# EAGLE schematic rev_n v28 (EAGLE 9.7.0)
AUTHOR: Pat Pannuto; REV: N; TITLE: TotTag

## Sheet 1 of 6: Power
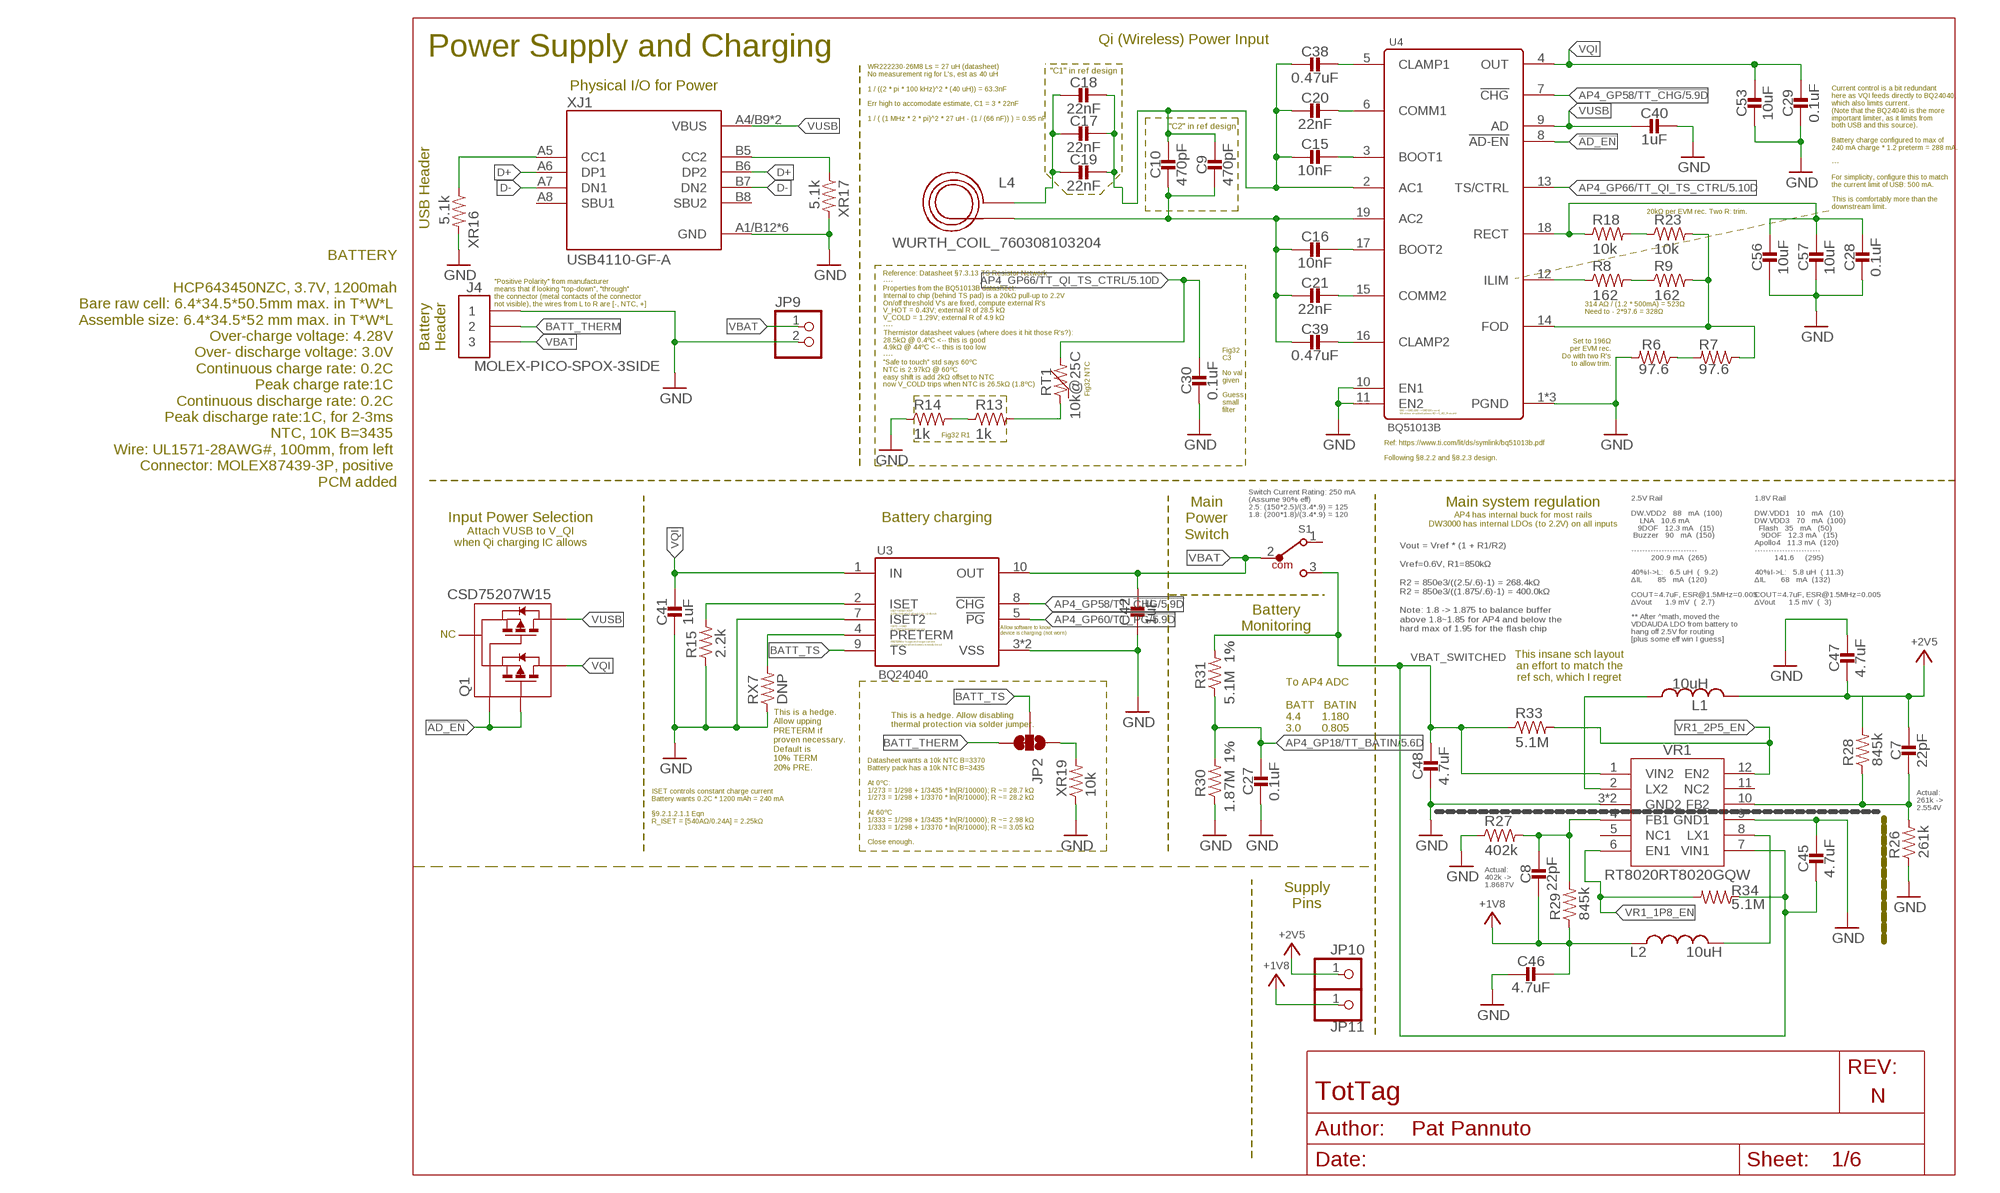
[diagram p0: schematic, sheet 1]

### Parts
C7  22pF  CAPACITOR0201_CAP  [0201_CAP]
C8  22pF  CAPACITOR0201_CAP  [0201_CAP]
C9  470pF  CAPACITOR0402_CAP  [0402_CAP]
C10  470pF  CAPACITOR0402_CAP  [0402_CAP]
C15  10nF  CAPACITOR0402_CAP  [0402_CAP]
C16  10nF  CAPACITOR0402_CAP  [0402_CAP]
C17  22nF  CAPACITOR0402_CAP  [0402_CAP]
C18  22nF  CAPACITOR0402_CAP  [0402_CAP]
C19  22nF  CAPACITOR0402_CAP  [0402_CAP]
C20  22nF  CAPACITOR0402_CAP  [0402_CAP]
C21  22nF  CAPACITOR0402_CAP  [0402_CAP]
C27  0.1uF  CAPACITOR0402_CAP  [0402_CAP]
C28  0.1uF  CAPACITOR0402_CAP  [0402_CAP]
C29  0.1uF  CAPACITOR0402_CAP  [0402_CAP]
C30  0.1uF  CAPACITOR0402_CAP  [0402_CAP]
C38  0.47uF  CAPACITOR0402_CAP  [0402_CAP]
C39  0.47uF  CAPACITOR0402_CAP  [0402_CAP]
C40  1uF  CAPACITOR0402_CAP  [0402_CAP]
C41  1uF  CAPACITOR0402_CAP  [0402_CAP]
C42  1uF  CAPACITOR0402_CAP  [0402_CAP]
C45  4.7uF  CAPACITOR0603_CAP  [0603_CAP]
C46  4.7uF  CAPACITOR0603_CAP  [0603_CAP]
C47  4.7uF  CAPACITOR0603_CAP  [0603_CAP]
C48  4.7uF  CAPACITOR0603_CAP  [0603_CAP]
C53  10uF  CAPACITOR0603_CAP  [0603_CAP]
C56  10uF  CAPACITOR0603_CAP  [0603_CAP]
C57  10uF  CAPACITOR0603_CAP  [0603_CAP]
J4  MOLEX-PICO-SPOX-3SIDE  [MOLEX-PICO-SPOX-3_SIDE]
JP2  JUMPER-SMT_3_1-NC_TRACE_SILK  [SMT-JUMPER_3_1-NC_TRACE_SILK]
JP9  PINHD-1X2  [1X02]
JP10  PINHD-1X1  [1X01]
JP11  PINHD-1X1  [1X01]
L1  10uH  INDUCTORNRX3015  [NRX3015]
L2  10uH  INDUCTORNRX3015  [NRX3015]
L4  WURTH_COIL_760308103204  [WURTH_COIL_760308103204]
Q1  CSD75207W15  [DSBGA]
R6  97.6  RESISTOR0402_RES  [0402_RES]
R7  97.6  RESISTOR0402_RES  [0402_RES]
R8  162  RESISTOR0402_RES  [0402_RES]
R9  162  RESISTOR0402_RES  [0402_RES]
R13  1k  RESISTOR0402_RES  [0402_RES]
R14  1k  RESISTOR0402_RES  [0402_RES]
R15  2.2k  RESISTOR0402_RES  [0402_RES]
R18  10k  RESISTOR0402_RES  [0402_RES]
R23  10k  RESISTOR0402_RES  [0402_RES]
R26  261k  RESISTOR0201_RES  [0201_RES]
R27  402k  RESISTOR0201_RES  [0201_RES]
R28  845k  RESISTOR0201_RES  [0201_RES]
R29  845k  RESISTOR0201_RES  [0201_RES]
R30  1.87M  RESISTOR0402_RES  [0402_RES]
R31  5.1M  RESISTOR0402_RES  [0402_RES]
R33  5.1M  RESISTOR0402_RES  [0402_RES]
R34  5.1M  RESISTOR0402_RES  [0402_RES]
RT1  10k@25C  THERMISTOR0402  [0402_RES]
RX7  DNP  RESISTOR0402_RES  [0402_RES]
S1  450404015514  [450404015514]
U3  BQ24040  [DSQ0010A]
U4  BQ51013B  [RHL0020A]
VR1  RT8020RT8020GQW  [SON45P300X300X80-13T160X250N]
XJ1  USB4110-GF-A  [GCT_USB4110-GF-A]
XR16  5.1k  RESISTOR0402_RES  [0402_RES]
XR17  5.1k  RESISTOR0402_RES  [0402_RES]
XR19  10k  RESISTOR0402_RES  [0402_RES]

### Nets
!AD_EN: Q1.A1(G1) Q1.C1(G2) U4.8(!AD-EN)
+1V8: C8.P$2 C46.1 JP11.1 L2.P$1 R29.1 ; also sheet 2,3,5,6
+2V5: C7.P$1 C47.2 JP10.1 L1.P$2 R28.2 ; also sheet 2,3,6
AP4_GP18/TT_BATIN: C27.1 R30.2 R31.1 ; also sheet 5
AP4_GP58/TT_!CHG: U3.8(!CHG) U4.7(!CHG) ; also sheet 5
AP4_GP60/TT_!PG: U3.5(!PG) ; also sheet 5
AP4_GP66/TT_QI_TS_CTRL: C30.1 RT1.2 U4.13(TS/CTRL) ; also sheet 5
BATT_THERM: J4.2 J4.2SUPP JP2.3
BATT_TS: JP2.2 U3.9(TS)
BQ_AC1: C9.1 C10.1 C15.2 C17.1 C18.1 C19.1 C20.2 C38.2 U4.2(AC1)
BQ_AC2: C9.2 C10.2 C16.2 C21.2 C39.2 L4.P$2 U4.19(AC2)
BQ_BOOT1: C15.1 U4.3(BOOT1)
BQ_BOOT2: C16.1 U4.17(BOOT2)
BQ_CLAMP1: C38.1 U4.5(CLAMP1)
BQ_CLAMP2: C39.1 U4.16(CLAMP2)
BQ_COMM1: C20.1 U4.6(COMM1)
BQ_COMM2: C21.1 U4.15(COMM2)
BQ_FOD: R7.1 R9.2 R23.2 U4.14(FOD)
BQ_ILM: R8.1 U4.12(ILIM)
BQ_ISET: R15.2 U3.2(ISET)
BQ_RECT: C28.1 C56.1 C57.1 R18.1 U4.18(RECT)
COIL_AC1: C17.2 C18.2 C19.2 L4.P$1
D+: XJ1.A6(DP1) XJ1.B6(DP2)
D-: XJ1.A7(DN1) XJ1.B7(DN2)
GND: C27.2 C28.2 C29.2 C30.2 C40.1 C41.2 C42.2 C45.1 C46.2 C47.1 C48.2 C53.2 C56.2 C57.2 J4.1 J4.1SUPP JP9.2 R6.2 R14.1 R15.1 R26.1 R27.1 R30.1 RX7.1 U3.3(VSS) U3.7(ISET2) U3.PAD(VSS) U4.1(PGND) U4.10(EN1) U4.11(EN2) U4.20(PGND) U4.PAD(PGND) VR1.3(GND2) VR1.9(GND1) VR1.13(GND2) XJ1.A1/B12(GND) XJ1.B1/A12(GND) XJ1.S1(GND) XJ1.S2(GND) XJ1.S3(GND) XJ1.S4(GND) XR16.2 XR17.2 XR19.1 ; also sheet 2,3,5,6
N$28: R6.1 R7.2
N$47: JP2.1 XR19.2
N$49: RX7.2 U3.4(PRETERM)
N$64: R18.2 R23.1
N$66: R8.2 R9.1
N$69: R13.2 RT1.1
N$70: R13.1 R14.2
USB_CC1: XJ1.A5(CC1) XR16.1
USB_CC2: XJ1.B5(CC2) XR17.1
VBAT: C42.1 J4.3 J4.3SUPP JP9.1 S1.2 U3.10(OUT)
VBAT_SWITCHED: C45.2 C48.1 R31.2 R33.1 R34.1 S1.3 VR1.1(VIN2) VR1.7(VIN1)
VQI: C29.1 C41.1 C53.1 Q1.A2(D1) Q1.A3(D1) Q1.B3(D1) U3.1(IN) U4.4(OUT)
VR1_1P8_EN: R34.2 VR1.6(EN1)
VR1_2P5_EN: R33.2 VR1.12(EN2)
VR1_FB1: C8.P$1 R27.2 R29.2 VR1.4(FB1)
VR1_FB2: C7.P$2 R26.2 R28.1 VR1.10(FB2)
VR1_LX1: L2.P$2 VR1.8(LX1)
VR1_LX2: L1.P$1 VR1.2(LX2)
VUSB: C40.2 Q1.B2(D2) Q1.C2(D2) Q1.C3(D2) U4.9(AD) XJ1.A4/B9(VBUS) XJ1.B4/A9(VBUS)
Unconnected: Q1.B1(S) S1.1 VR1.5(NC1) VR1.11(NC2) XJ1.A8(SBU1) XJ1.B8(SBU2)

### Notes on the sheet
- Power Supply and Charging | Qi (Wireless) Power Input
- WR222230-26M8 Ls = 27 uH (datasheet)
  No measurement rig for L's, est as 40 uH
  
  1 / ((2 * pi * 100 kHz)^2 * (40 uH)) = 63.3nF
  
  Err high to accomodate estimate, C1 = 3 * 22nF
  
  1 / ( (1 MHz * 2 * pi)^2 * 27 uH - (1 / (66 nF)) ) = 0.95 nF
- "C1" in ref design
- Physical I/O for Power
- "C2" in ref design
- USB Header
- 20kΩ per EVM rec. Two R: trim.
- Current control is a bit redundant
  here as VQI feeds directly to BQ24040,
  which also limits current.
  (Note that the BQ24040 is the more
  important limiter, as it limits from
  both USB and this source).
  
  Battery charge configured to max of
  240 mA charge * 1.2 preterm = 288 mA.
  
  ---
  
  For simplicity, configure this to match
  the current limit of USB: 500 mA.
  
  This is comfortably more than the
  downstream limit.
- BATTERY
  
  HCP643450NZC, 3.7V, 1200mah
  Bare raw cell: 6.4*34.5*50.5mm max. in T*W*L 
  Assemble size: 6.4*34.5*52 mm max. in T*W*L 
  Over-charge voltage: 4.28V 
  Over- discharge voltage: 3.0V 
  Continuous charge rate: 0.2C 
  Peak charge rate:1C 
  Continuous discharge rate: 0.2C 
  Peak discharge rate:1C, for 2-3ms 
  NTC, 10K B=3435 
  Wire: UL1571-28AWG#, 100mm, from left 
  Connector: MOLEX87439-3P, positive 
  PCM added
- Reference: Datasheet §7.3.13 TS Resistor Network
  ----
  Properties from the BQ51013B datasheet:
  Internal to chip (behind TS pad) is a 20kΩ pull-up to 2.2V
  On/off threshold V's are fixed, compute external R's
  V_HOT = 0.43V; external R of 28.5 kΩ
  V_COLD = 1.29V; external R of 4.9 kΩ
  ----
  Thermistor datasheet values (where does it hit those R's?):
  28.5kΩ @ 0.4ºC <-- this is good
  4.9kΩ @ 44ºC <-- this is too low
  ----
  "Safe to touch" std says 60ºC
  NTC is 2.97kΩ @ 60ºC
  easy shift is add 2kΩ offset to NTC
  now V_COLD trips when NTC is 26.5kΩ (1.8ºC)
- 314 AΩ / (1.2 * 500mA) = 523Ω
  Need to - 2*97.6 = 328Ω
- "Positive Polarity" from manufacturer
  means that if looking "top-down", "through"
  the connector (metal contacts of the connector
  not visible), the wires from L to R are [-, NTC, +]
- Battery
  Header
- Set to 196Ω
  per EVM rec.
  Do with two R's
  to allow trim.
- Fig32
  C3
  
  No val
  given
  
  Guess
  small
  filter
- Fig32 NTC
- EN1 -> GND, EN2 -> GND [00 case]
  Wireless enabled unless AD > V_AD_Present
- Fig32 R1
- Ref: https://www.ti.com/lit/ds/symlink/bq51013b.pdf
  
  Following §8.2.2 and §8.2.3 design.
- Switch Current Rating: 250 mA
  (Assume 90% eff)
  2.5: (150*2.5)/(3.4*.9) = 125
  1.8: (200*1.8)/(3.4*.9) = 120
- Main
  Power
  Switch
- Main system regulation
- 2.5V Rail
  
  DW.VDD2   88   mA  (100)
      LNA   10.6 mA
     9DOF   12.3 mA   (15)
   Buzzer   90   mA  (150)
  
  ------------------------
           200.9 mA  (265)
  
  40%I->L:   6.5 uH  (  9.2)
  ∆IL       85   mA  (120)
  
  COUT=4.7uF, ESR@1.5MHz=0.005
  ∆Vout      1.9 mV  (  2.7)
  
  ** After ^math, moved the
  VDDAUDA LDO from battery to
  hang off 2.5V for routing
  [plus some eff win I guess]
- 1.8V Rail
  
  DW.VDD1   10   mA   (10)
  DW.VDD3   70   mA  (100)
    Flash   35   mA   (50)
     9DOF   12.3 mA   (15)
  Apollo4   11.3 mA  (120)
  ------------------------
           141.6     (295)
  
  40%I->L:   5.8 uH  ( 11.3)
  ∆IL       68   mA  (132)
  
  COUT=4.7uF, ESR@1.5MHz=0.005
  ∆Vout      1.5 mV  (  3)
- Input Power Selection | Battery charging
- AP4 has internal buck for most rails
  DW3000 has internal LDOs (to 2.2V) on all inputs
- Attach VUSB to V_QI
  when Qi charging IC allows
- Vout = Vref * (1 + R1/R2)
  
  Vref=0.6V, R1=850kΩ
  
  R2 = 850e3/((2.5/.6)-1) = 268.4kΩ
  R2 = 850e3/((1.875/.6)-1) = 400.0kΩ
  
  Note: 1.8 -> 1.875 to balance buffer
  above 1.8~1.85 for AP4 and below the
  hard max of 1.95 for the flash chip
- Battery
  Monitoring
- ISET = KISET / IOUT
  2.25k = 540 AΩ / 240 mA; 2.2k -> 245 mA
- ISET2 -> GND
  Use ISET to limit input current
- Allow software to know
  device is charging (not worn)
- NC
- PRETERM is %age of charge current
  system uses when battery is totally dead
- This insane sch layout
  an effort to match the
  ref sch, which I regret
- This is a hedge.
  Allow upping
  PRETERM if
  proven necessary.
  Default is
  10% TERM
  20% PRE.
- This is a hedge. Allow disabling
  thermal protection via solder jumper.
- To AP4 ADC
  
  BATT   BATIN
  4.4       1.180
  3.0       0.805
- Datasheet wants a 10k NTC B=3370
  Battery pack has a 10k NTC B=3435
  
  At 0ºC:
  1/273 = 1/298 + 1/3435 * ln(R/10000); R ~= 28.7 kΩ
  1/273 = 1/298 + 1/3370 * ln(R/10000); R ~= 28.2 kΩ
  
  At 60ºC
  1/333 = 1/298 + 1/3435 * ln(R/10000); R ~= 2.98 kΩ
  1/333 = 1/298 + 1/3370 * ln(R/10000); R ~= 3.05 kΩ
  
  Close enough.
- ISET controls constant charge current
  Battery wants 0.2C * 1200 mAh = 240 mA
  
  §9.2.1.2.1.1 Eqn
  R_ISET = [540AΩ/0.24A] = 2.25kΩ
- Actual:
  261k ->
  2.554V
- Actual:
  402k ->
  1.8687V
- Supply
  Pins

## Sheet 2 of 6: Flash, 9-DOF, Buzzer
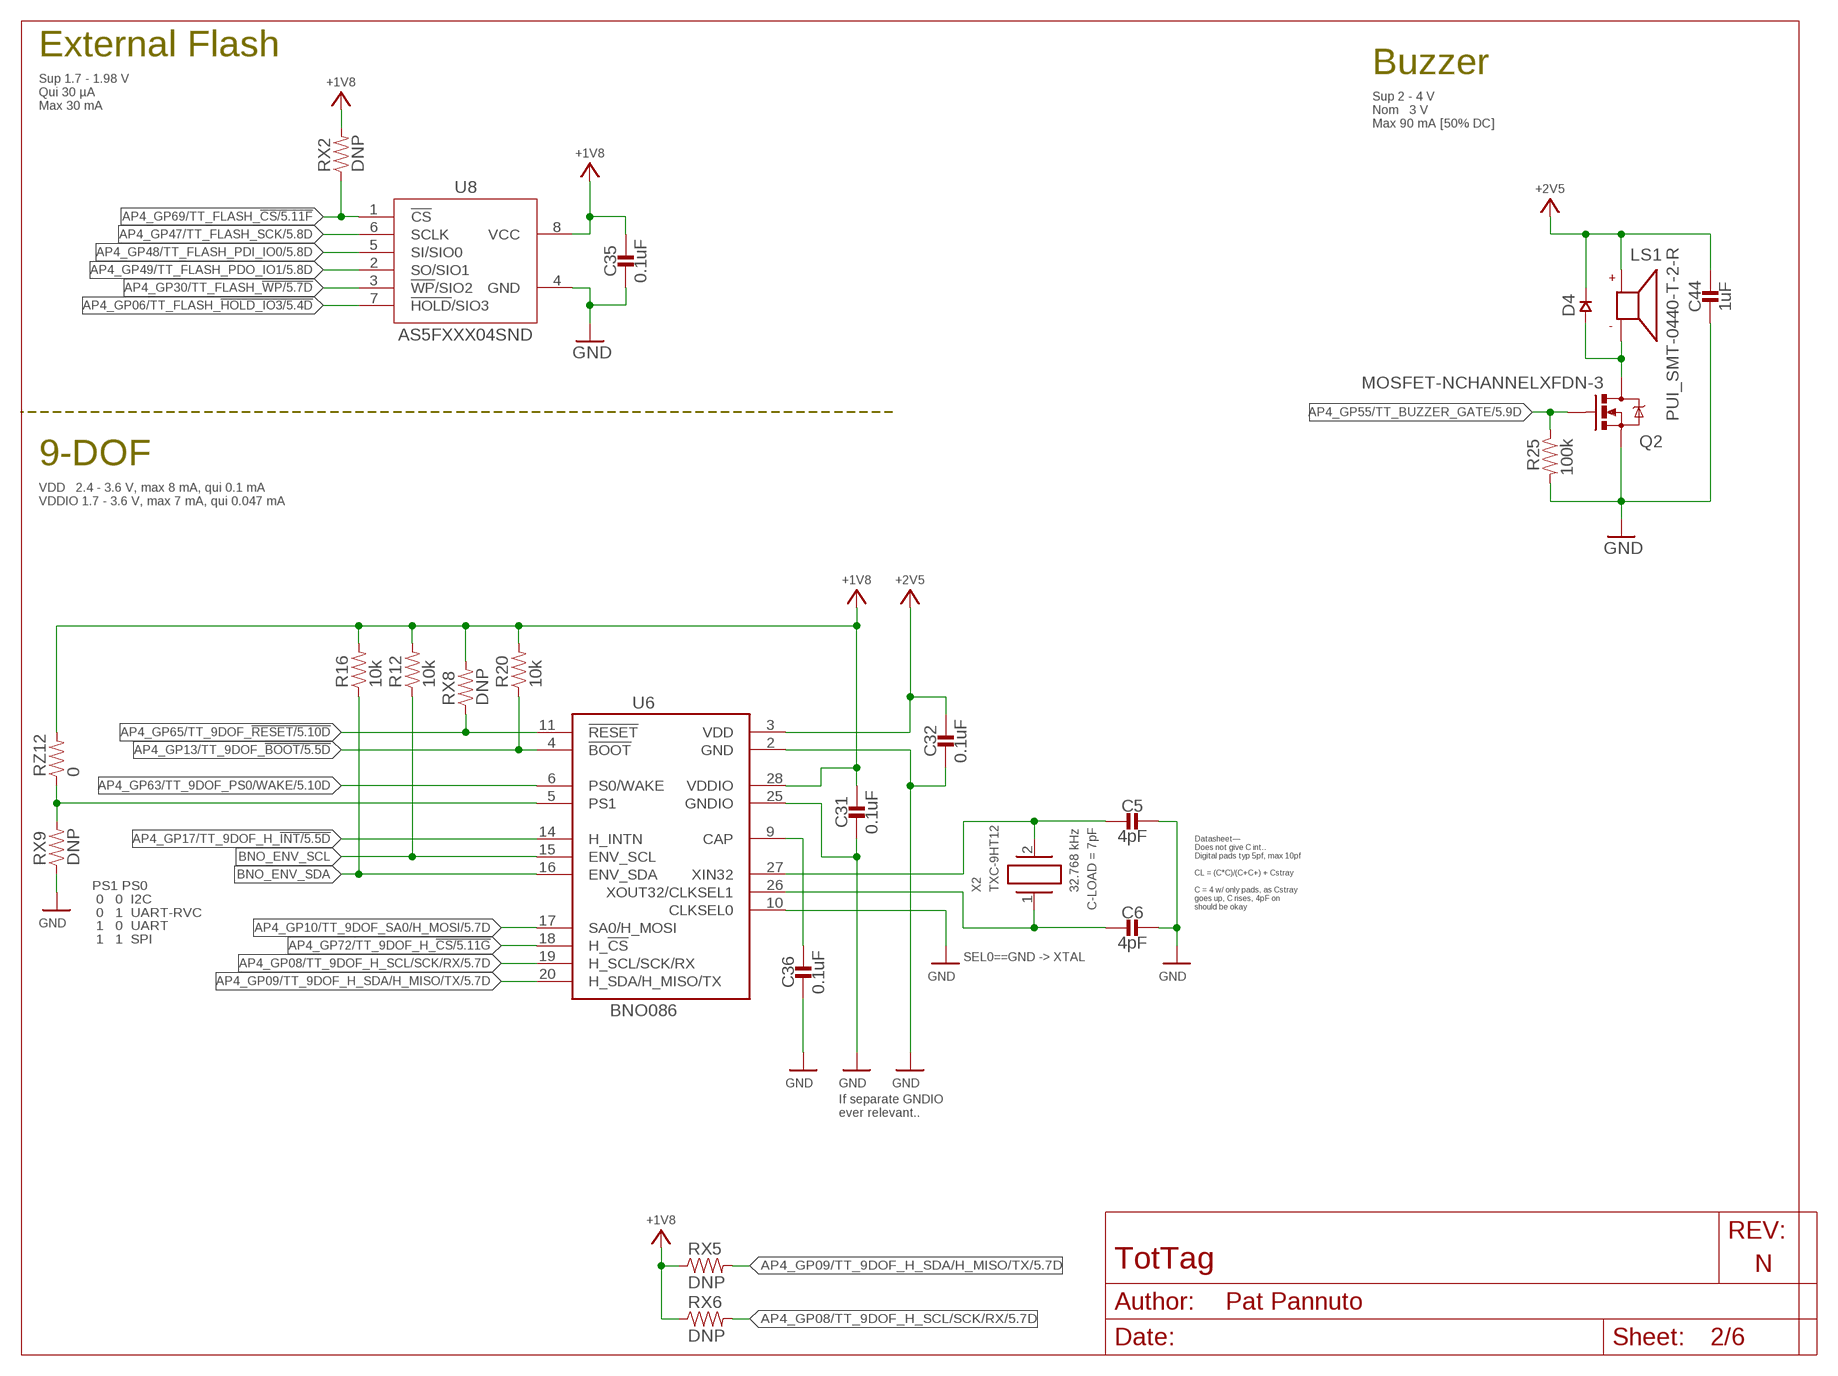
[diagram p1: schematic, sheet 2]

### Parts
C5  4pF  CAPACITOR0201_CAP  [0201_CAP]
C6  4pF  CAPACITOR0201_CAP  [0201_CAP]
C31  0.1uF  CAPACITOR0402_CAP  [0402_CAP]
C32  0.1uF  CAPACITOR0402_CAP  [0402_CAP]
C35  0.1uF  CAPACITOR0402_CAP  [0402_CAP]
C36  0.1uF  CAPACITOR0402_CAP  [0402_CAP]
C44  1uF  CAPACITOR0402_CAP  [0402_CAP]
D4  DIODE0402  [0402_DIODE]
LS1  PUI_SMT-0440-T-2-R  [SMT-0440-T-2-R]
Q2  MOSFET-NCHANNELXFDN-3  [XFDFN-3]
R12  10k  RESISTOR0402_RES  [0402_RES]
R16  10k  RESISTOR0402_RES  [0402_RES]
R20  10k  RESISTOR0402_RES  [0402_RES]
R25  100k  RESISTOR0402_RES  [0402_RES]
RX2  DNP  RESISTOR0603_RES  [0603-RES]
RX5  DNP  RESISTOR0603_RES  [0603-RES]
RX6  DNP  RESISTOR0603_RES  [0603-RES]
RX8  DNP  RESISTOR0603_RES  [0603-RES]
RX9  DNP  RESISTOR0603_RES  [0603-RES]
RZ12  0  RESISTOR0402_RES  [0402_RES]
U6  BNO086  [LGA28R0P510X4_5P2X3P8X1]
U8  AS5FXXX04SND  [AS5FXXXXXXXX-XXLXN]
X2  TXC-9HT12  [TXC-9HT12]

### Nets
9DOF_CAP: C36.1 U6.9(CAP)
9DOF_XI: C5.P$2 U6.27(XIN32) X2.2
9DOF_XO: C6.P$2 U6.26(XOUT32/CLKSEL1) X2.1
+1V8: C31.1 C35.1 R12.2 R16.2 R20.2 RX2.2 RX5.1 RX6.1 RX8.2 RZ12.2 U6.28(VDDIO) U8.8(VCC) ; also sheet 1,3,5,6
+2V5: C32.1 C44.1 D4.CATHODE LS1.+(P) U6.3(VDD) ; also sheet 1,3,6
AP4_GP06/TT_FLASH_!HOLD_IO3: U8.7(!HOLD!/SIO3) ; also sheet 5
AP4_GP08/TT_9DOF_H_SCL/SCK/RX: RX6.2 U6.19(H_SCL/SCK/RX) ; also sheet 5
AP4_GP09/TT_9DOF_H_SDA/H_MISO/TX: RX5.2 U6.20(H_SDA/H_MISO/TX) ; also sheet 5
AP4_GP10/TT_9DOF_SA0/H_MOSI: U6.17(SA0/H_MOSI) ; also sheet 5
AP4_GP13/TT_9DOF_!BOOT: R20.1 U6.4(!BOOT) ; also sheet 5
AP4_GP17/TT_9DOF_H_!INT: U6.14(H_INTN) ; also sheet 5
AP4_GP30/TT_FLASH_!WP: U8.3(!WP!/SIO2) ; also sheet 5
AP4_GP47/TT_FLASH_SCK: U8.6(SCLK) ; also sheet 5
AP4_GP48/TT_FLASH_PDI_IO0: U8.5(SI/SIO0) ; also sheet 5
AP4_GP49/TT_FLASH_PDO_IO1: U8.2(SO/SIO1) ; also sheet 5
AP4_GP55/TT_BUZZER_GATE: Q2.G R25.1 ; also sheet 5
AP4_GP63/TT_9DOF_PS0/WAKE: U6.6(PS0/WAKE) ; also sheet 5
AP4_GP65/TT_9DOF_!RESET: RX8.1 U6.11(!RESET) ; also sheet 5
AP4_GP69/TT_FLASH_!CS: RX2.1 U8.1(!CS) ; also sheet 5
AP4_GP72/TT_9DOF_H_!CS: U6.18(H_!CS) ; also sheet 5
BNO_ENV_SCL: R12.1 U6.15(ENV_SCL)
BNO_ENV_SDA: R16.1 U6.16(ENV_SDA)
BNO_PS1: RX9.2 RZ12.1 U6.5(PS1)
GND: C5.P$1 C6.P$1 C31.2 C32.2 C35.2 C36.2 C44.2 Q2.S R25.2 RX9.1 U6.2(GND) U6.10(CLKSEL0) U6.25(GNDIO) U8.4(GND) ; also sheet 1,3,5,6
N$2: D4.ANODE LS1.-(N) Q2.D

### Notes on the sheet
- External Flash
- Sup 1.7 - 1.98 V
  Qui 30 µA
  Max 30 mA
- Buzzer
- Sup 2 - 4 V
  Nom   3 V
  Max 90 mA [50% DC]
- 9-DOF
- VDD   2.4 - 3.6 V, max 8 mA, qui 0.1 mA
  VDDIO 1.7 - 3.6 V, max 7 mA, qui 0.047 mA
- PS1 PS0
   0   0  I2C
   0   1  UART-RVC
   1   0  UART
   1   1  SPI
- Datasheet—
  Does not give C int..
  Digital pads typ 5pf, max 10pf
  
  CL = (C*C)/(C+C+) + Cstray
  
  C = 4 w/ only pads, as Cstray
  goes up, C rises, 4pF on
  should be okay
- SEL0==GND -> XTAL
- If separate GNDIO
  ever relevant..

## Sheet 3 of 6: Localization module
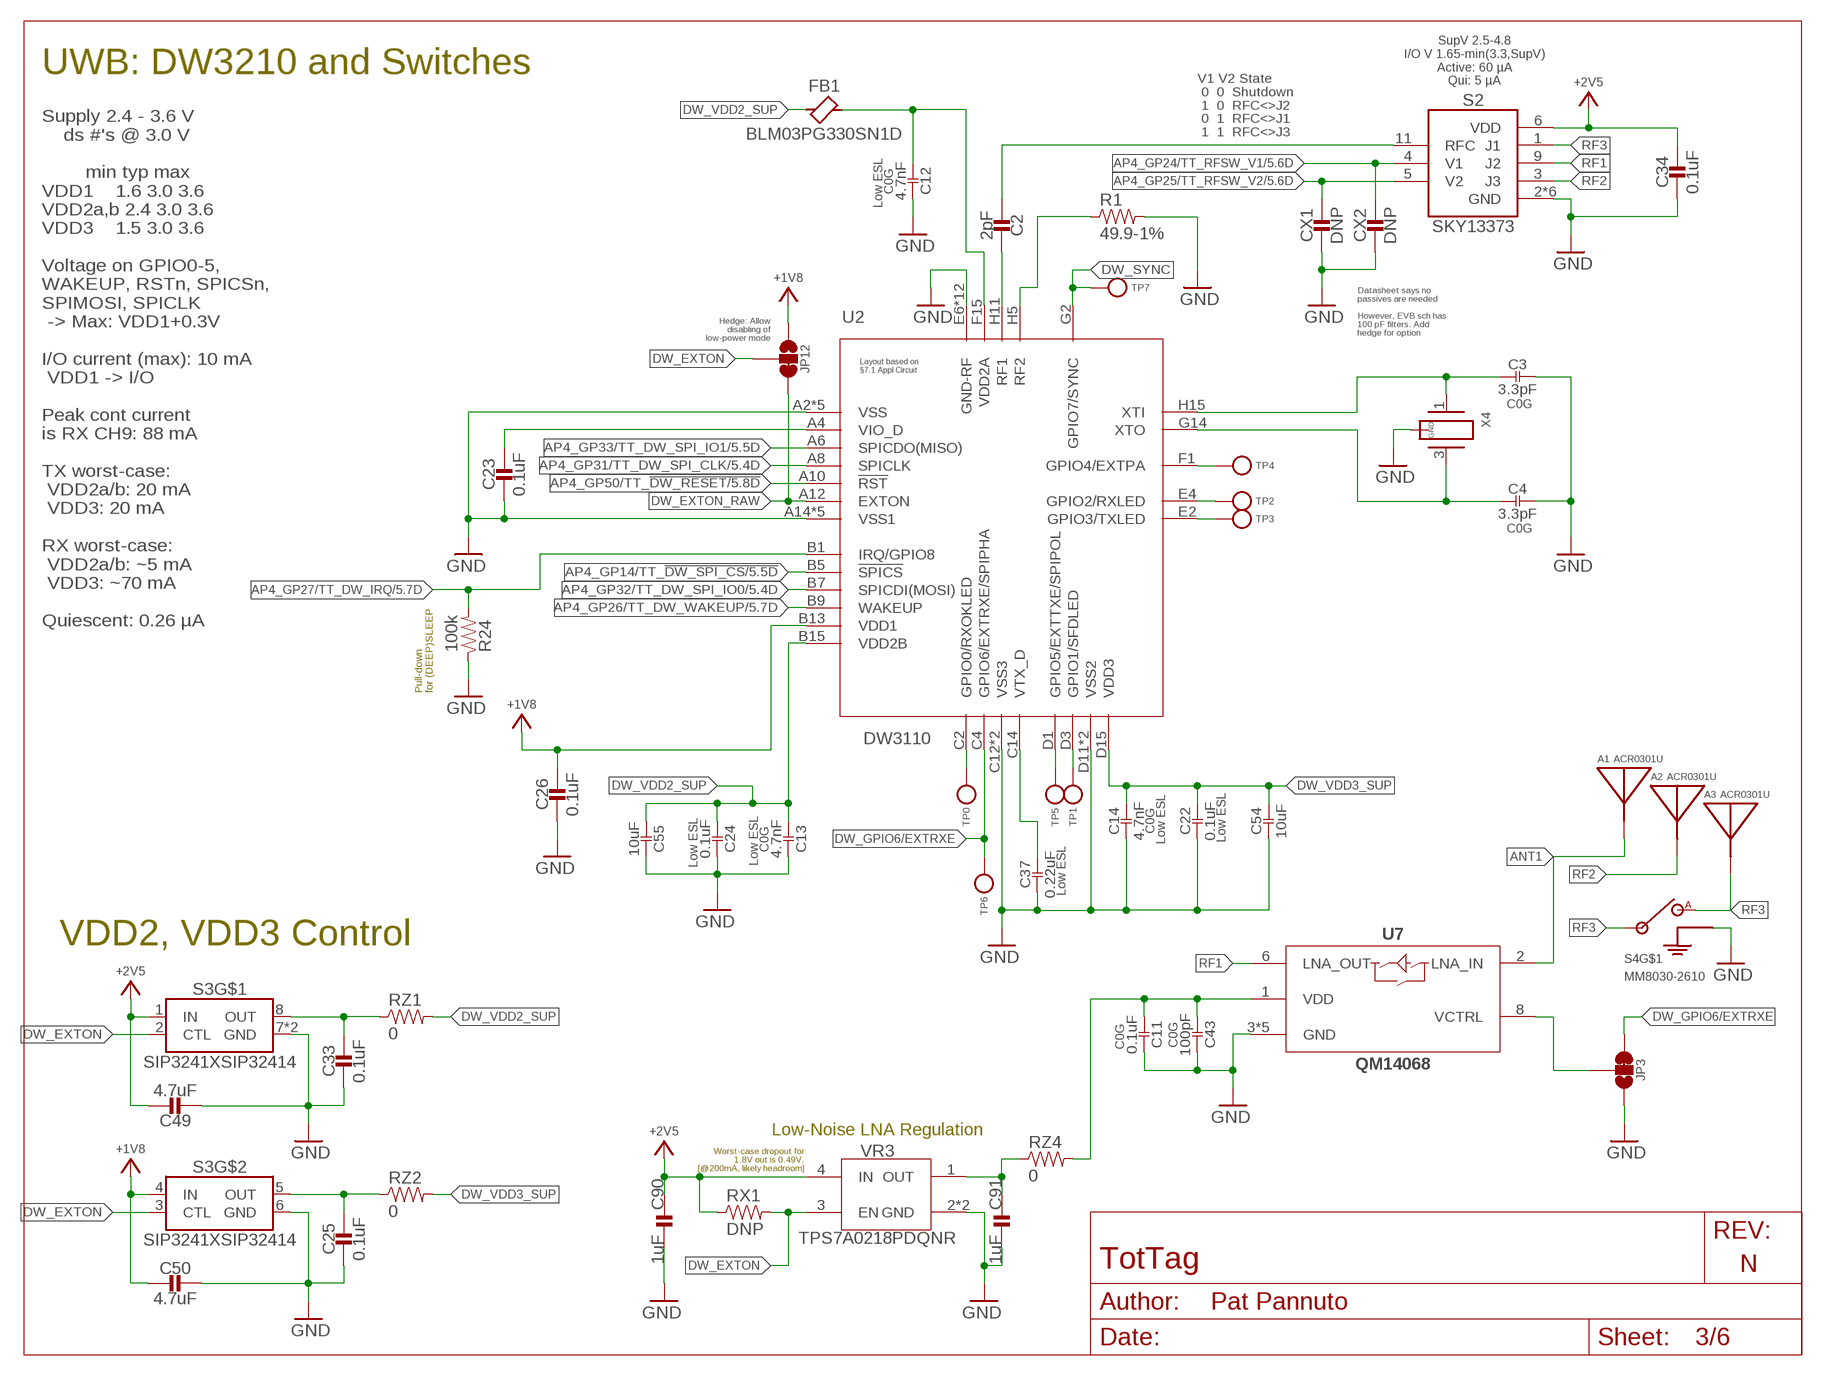
[diagram p2: schematic, sheet 3]

### Parts
A1  ACR0301U  [ACR0301U]
A2  ACR0301U  [ACR0301U]
A3  ACR0301U  [ACR0301U]
C2  2pF  CAPACITOR0201_CAP  [0201_CAP]
C3  3.3pF  C0805US  [SMD_2012M-0805US-C]
C4  3.3pF  C0805US  [SMD_2012M-0805US-C]
C11  0.1uF  C1206US  [SMD_3216M-1206US-C]
C12  4.7nF  C0603US  [SMD_1608M-0603US-C]
C13  4.7nF  C0603US  [SMD_1608M-0603US-C]
C14  4.7nF  C0603US  [SMD_1608M-0603US-C]
C22  0.1uF  C0603US  [SMD_1608M-0603US-C]
C23  0.1uF  CAPACITOR0402_CAP  [0402_CAP]
C24  0.1uF  C0603US  [SMD_1608M-0603US-C]
C25  0.1uF  CAPACITOR0402_CAP  [0402_CAP]
C26  0.1uF  CAPACITOR0402_CAP  [0402_CAP]
C33  0.1uF  CAPACITOR0402_CAP  [0402_CAP]
C34  0.1uF  CAPACITOR0402_CAP  [0402_CAP]
C37  0.22uF  C0603US  [SMD_1608M-0603US-C]
C43  100pF  C0402US  [SMD_1005M-0402US-C]
C49  4.7uF  CAPACITOR0603_CAP  [0603_CAP]
C50  4.7uF  CAPACITOR0603_CAP  [0603_CAP]
C54  10uF  C0603US  [SMD_1608M-0603US-C]
C55  10uF  C0603US  [SMD_1608M-0603US-C]
C90  1uF  CAPACITOR0201_CAP  [0201_CAP]
C91  1uF  CAPACITOR0201_CAP  [0201_CAP]
CX1  DNP  CAPACITOR0603_CAP  [0603_CAP]
CX2  DNP  CAPACITOR0603_CAP  [0603_CAP]
FB1  BLM03PG330SN1D  FERRITE_BEAD0201  [0201_FB]
JP3  JUMPER-SMT_3_1-NC_TRACE_SILK  [SMT-JUMPER_3_1-NC_TRACE_SILK]
JP12  JUMPER-SMT_3_1-NC_TRACE_SILK  [SMT-JUMPER_3_1-NC_TRACE_SILK]
R1  49.9-1%  RESISTOR0201_RES  [0201_RES]
R24  100k  RESISTOR0402_RES  [0402_RES]
RX1  DNP  RESISTOR0603_RES  [0603-RES]
RZ1  0  RESISTOR0603_RES  [0603-RES]
RZ2  0  RESISTOR0603_RES  [0603-RES]
RZ4  0  RESISTOR0402_RES  [0402_RES]
S2  SKY13373  [SKY13373]
S3  SIP3241XSIP32414  [TDFN2X2X0P6-8]
S4  MM8030-2610  [MM8030-2610]
TP0  TEST-POINT  [PAD.03X.03]
TP1  TEST-POINT  [PAD.03X.03]
TP2  TEST-POINT  [PAD.03X.03]
TP3  TEST-POINT  [PAD.03X.03]
TP4  TEST-POINT  [PAD.03X.03]
TP5  TEST-POINT  [PAD.03X.03]
TP6  TEST-POINT  [PAD.03X.03]
TP7  TEST-POINT  [PAD.03X.03]
U2  DW3110  [WLCSP52]
U7  QM14068  [QM14068]
VR3  TPS7A0218PDQNR  [4-XDFN-EP]
X4  TXC-8Y  [TXC-8Y]

### Nets
+1V8: C26.1 C50.2 JP12.1 S3.4(IN) U2.B13(VDD1) ; also sheet 1,2,5,6
+2V5: C34.1 C49.1 C90.P$1 RX1.1 S2.6(VDD) S3.1(IN) VR3.4(IN) ; also sheet 1,2,6
ANT1: A1.FEED(ANTENNA) U7.2(LNA_IN)
AP4_GP14/TT_!DW_SPI_CS: U2.B5(!SPICS) ; also sheet 5
AP4_GP24/TT_RFSW_V1: CX2.1 S2.4(V1) ; also sheet 5
AP4_GP25/TT_RFSW_V2: CX1.1 S2.5(V2) ; also sheet 5
AP4_GP26/TT_DW_WAKEUP: U2.B9(WAKEUP) ; also sheet 5
AP4_GP27/TT_DW_IRQ: R24.2 U2.B1(IRQ/GPIO8) ; also sheet 5
AP4_GP31/TT_DW_SPI_CLK: U2.A8(SPICLK) ; also sheet 5
AP4_GP32/TT_DW_SPI_IO0: U2.B7(SPICDI(MOSI)) ; also sheet 5
AP4_GP33/TT_DW_SPI_IO1: U2.A6(SPICDO(MISO)) ; also sheet 5
AP4_GP50/TT_!DW_RESET: U2.A10(!RST) ; also sheet 5
DW_EXTON: JP12.2 RX1.2 S3.2(CTL) S3.3(CTL) VR3.3(EN)
DW_EXTON_RAW: JP12.3 U2.A12(EXTON)
DW_GPIO4: TP4.P$1(TESTPOINT) U2.F1(GPIO4/EXTPA)
DW_GPIO5: TP5.P$1(TESTPOINT) U2.D1(GPIO5/EXTTXE/SPIPOL)
DW_GPIO6/EXTRXE: JP3.3 TP6.P$1(TESTPOINT) U2.C4(GPIO6/EXTRXE/SPIPHA)
DW_RF1 [UWB_RF]: C2.P$1 U2.H11(RF1)
DW_RF2: R1.1 U2.H5(RF2)
DW_RXLED: TP2.P$1(TESTPOINT) U2.E4(GPIO2/RXLED)
DW_RXOKLED: TP0.P$1(TESTPOINT) U2.C2(GPIO0/RXOKLED)
DW_SFDLED: TP1.P$1(TESTPOINT) U2.D3(GPIO1/SFDLED)
DW_SYNC: TP7.P$1(TESTPOINT) U2.G2(GPIO7/SYNC)
DW_TXLED: TP3.P$1(TESTPOINT) U2.E2(GPIO3/TXLED)
DW_VDD2_PWROUT: C33.1 RZ1.1 S3.8(OUT)
DW_VDD2_SUP: C13.P$1 C24.P$1 C55.P$1 FB1.P$1 RZ1.2 U2.B15(VDD2B)
DW_VDD2A: C12.P$1 FB1.P$2 U2.F15(VDD2A)
DW_VDD3_PWROUT: C25.1 RZ2.1 S3.5(OUT)
DW_VDD3_SUP: C14.P$2 C22.P$2 C54.P$2 RZ2.2 U2.D15(VDD3)
DW_VIO_D: C23.1 U2.A4(VIO_D)
DW_VTX_D: C37.P$2 U2.C14(VTX_D)
DW_XT0 [UWB_XTAL]: C4.P$1 U2.G14(XTO) X4.3
DW_XTI [UWB_XTAL]: C3.P$1 U2.H15(XTI) X4.1
GND: C3.P$2 C4.P$2 C11.P$2 C12.P$2 C13.P$2 C14.P$1 C22.P$1 C23.2 C24.P$2 C25.2 C26.2 C33.2 C34.2 C37.P$1 C43.P$2 C49.2 C50.1 C54.P$1 C55.P$2 C90.P$2 C91.P$2 CX1.2 CX2.2 JP3.1 R1.2 R24.1 S2.2(GND) S2.7(GND) S2.8(GND) S2.10(GND) S2.12(GND) S2.PAD(GND) S3.6(GND) S3.7(GND) S3.PAD(GND) S4.G1(GND) S4.G2(GND) U2.A2(VSS) U2.A14(VSS1) U2.B3(VSS) U2.B11(VSS1) U2.C6(VSS) U2.C8(VSS1) U2.C10(VSS1) U2.C12(VSS3) U2.D5(VSS) U2.D7(VSS) U2.D9(VSS1) U2.D11(VSS2) U2.D13(VSS3) U2.E6(GND-RF) U2.E10(GND-RF) U2.E12(GND-RF) U2.E14(VSS2) U2.F7(GND-RF) U2.F9(GND-RF) U2.G6(GND-RF) U2.G10(GND-RF) U2.H1(GND-RF) U2.H3(GND-RF) U2.H7(GND-RF) U2.H9(GND-RF) U2.H13(GND-RF) U7.3(GND) U7.4(GND) U7.5(GND) U7.7(GND) U7.9(GND) VR3.2(GND) VR3.PAD(GND) X4.2(GND) X4.4(GND) ; also sheet 1,2,5,6
LNA_VCTRL: JP3.2 U7.8(VCTRL)
RF1 [UWB_RF]: S2.9(J2) U7.6(LNA_OUT)
RF2 [UWB_RF]: A2.FEED(ANTENNA) S2.3(J3)
RF3 [UWB_RF]: A3.FEED(ANTENNA) S2.1(J1) S4.IN S4.OUT(A)
RFC [UWB_RF]: C2.P$2 S2.11(RFC)
VDD_LNA: C11.P$1 C43.P$1 RZ4.2 U7.1(VDD)
VR3_OUT: C91.P$1 RZ4.1 VR3.1(OUT)

### Notes on the sheet
- UWB: DW3210 and Switches
- V1 V2 State
   0  0  Shutdown
   1  0  RFC<>J2
   0  1  RFC<>J1
   1  1  RFC<>J3
- SupV 2.5-4.8
  I/O V 1.65-min(3.3,SupV)
  Active: 60 µA
  Qui: 5 µA
- Supply 2.4 - 3.6 V
      ds #'s @ 3.0 V
  
          min typ max
  VDD1    1.6 3.0 3.6
  VDD2a,b 2.4 3.0 3.6
  VDD3    1.5 3.0 3.6
  
  Voltage on GPIO0-5,
  WAKEUP, RSTn, SPICSn,
  SPIMOSI, SPICLK
   -> Max: VDD1+0.3V
  
  I/O current (max): 10 mA
   VDD1 -> I/O
  
  Peak cont current
  is RX CH9: 88 mA
  
  TX worst-case:
   VDD2a/b: 20 mA
   VDD3: 20 mA
  
  RX worst-case:
   VDD2a/b: ~5 mA
   VDD3: ~70 mA
  
  Quiescent: 0.26 µA
- Datasheet says no
  passives are needed
  
  However, EVB sch has
  100 pF filters. Add
  hedge for option
- Hedge: Allow
  disabling of
  low-power mode
- Pull-down
  for (DEEP)SLEEP
- VDD2, VDD3 Control
- Low-Noise LNA Regulation
- Worst-case dropout for
  1.8V out is 0.49V.
  [@200mA, likely headroom]

## Sheet 4 of 6: External signals
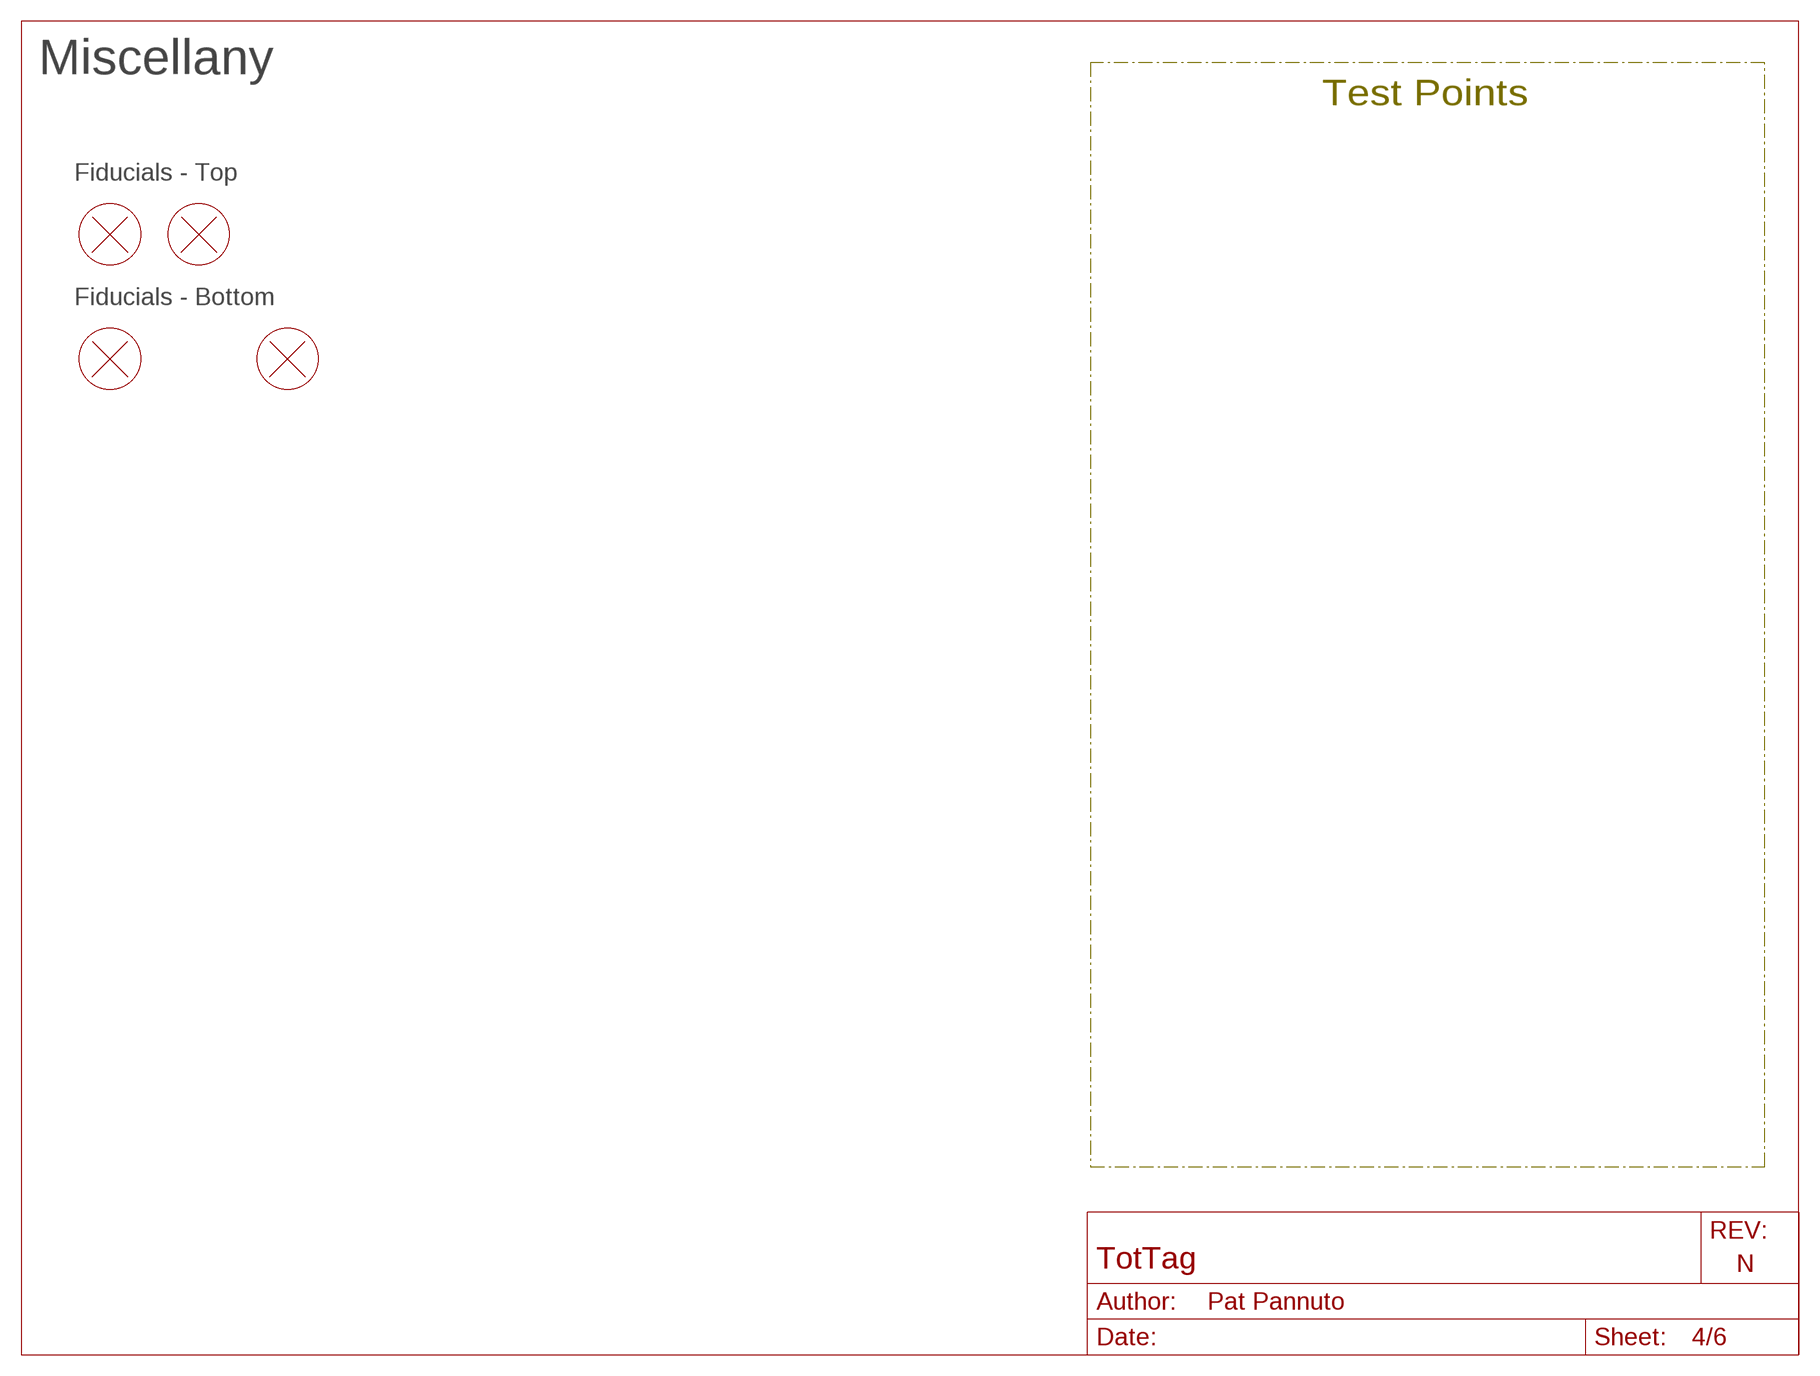
[diagram p3: schematic, sheet 4]

### Parts
FD1  FIDUCIAL  [FIDUCIAL_1MM-CU_2MM-MASK]
FD2  FIDUCIAL  [FIDUCIAL_1MM-CU_2MM-MASK]
FD4  FIDUCIAL  [FIDUCIAL_1MM-CU_2MM-MASK]
FD6  FIDUCIAL  [FIDUCIAL_1MM-CU_2MM-MASK]

### Notes on the sheet
- Miscellany
- Test Points
- Fiducials - Top
- Fiducials - Bottom

## Sheet 5 of 6: Apollo4 IC
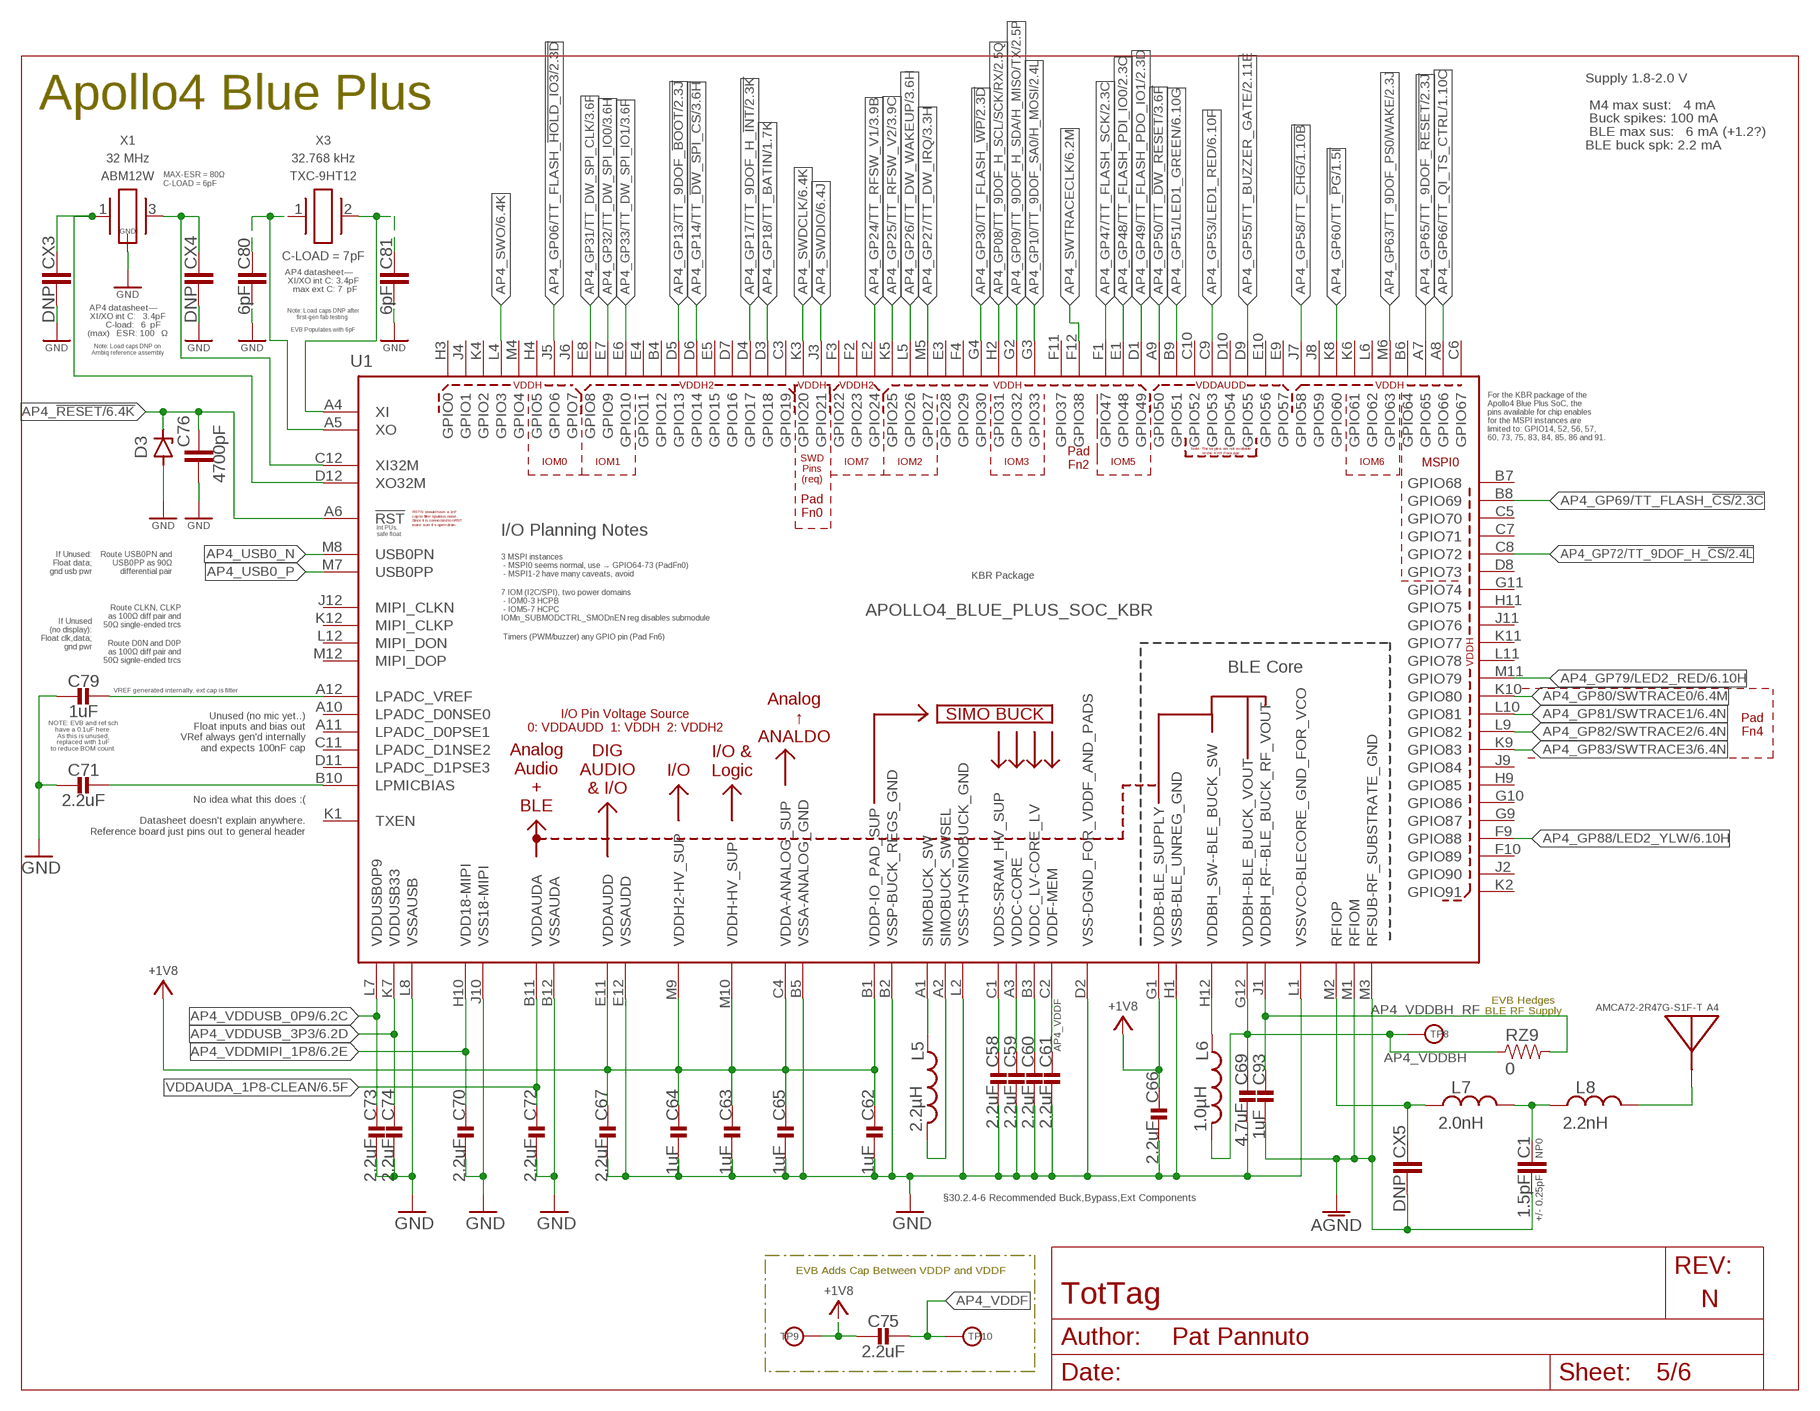
[diagram p4: schematic, sheet 5]

### Parts
A4  AMCA72-2R47G-S1F-T  [AMCA72-2R470G-S1F-T]
C1  1.5pF  C_CHIP-0402(1005-METRIC)  [CAPC1005X60]
C58  2.2uF  CAPACITOR0201_CAP  [0201_CAP]
C59  2.2uF  CAPACITOR0201_CAP  [0201_CAP]
C60  2.2uF  CAPACITOR0201_CAP  [0201_CAP]
C61  2.2uF  CAPACITOR0201_CAP  [0201_CAP]
C62  1uF  CAPACITOR0201_CAP  [0201_CAP]
C63  1uF  CAPACITOR0201_CAP  [0201_CAP]
C64  1uF  CAPACITOR0201_CAP  [0201_CAP]
C65  1uF  CAPACITOR0201_CAP  [0201_CAP]
C66  2.2uF  CAPACITOR0201_CAP  [0201_CAP]
C67  2.2uF  CAPACITOR0201_CAP  [0201_CAP]
C69  4.7uF  CAPACITOR0402_CAP  [0402_CAP]
C70  2.2uF  CAPACITOR0201_CAP  [0201_CAP]
C71  2.2uF  CAPACITOR0201_CAP  [0201_CAP]
C72  2.2uF  CAPACITOR0201_CAP  [0201_CAP]
C73  2.2uF  CAPACITOR0201_CAP  [0201_CAP]
C74  2.2uF  CAPACITOR0201_CAP  [0201_CAP]
C75  2.2uF  CAPACITOR0201_CAP  [0201_CAP]
C76  4700pF  C_CHIP-0402(1005-METRIC)  [CAPC1005X60]
C79  1uF  CAPACITOR0201_CAP  [0201_CAP]
C80  6pF  C_CHIP-0402(1005-METRIC)  [CAPC1005X60]
C81  6pF  C_CHIP-0402(1005-METRIC)  [CAPC1005X60]
C93  1uF  CAPACITOR0201_CAP  [0201_CAP]
CX3  DNP  C_CHIP-0402(1005-METRIC)  [CAPC1005X60]
CX4  DNP  C_CHIP-0402(1005-METRIC)  [CAPC1005X60]
CX5  DNP  C_CHIP-0402(1005-METRIC)  [CAPC1005X60]
D3  ZENER  ZENER_SODFL(1608-METRIC)  [SODFL1608X70]
L5  2.2µH  INDUCTOR0805  [0805_CAP]
L6  1.0µH  INDUCTOR0603  [0603_CAP]
L7  2.0nH  L_CHIP-0402(1006-METRIC)  [INDC1006X60N]
L8  2.2nH  L_CHIP-0402(1006-METRIC)  [INDC1006X60N]
RZ9  0  RESISTOR0402_RES  [0402_RES]
TP8  VDDBH  TEST-POINT  [PAD.03X.03]
TP9  VDDP  TEST-POINT  [PAD.03X.03]
TP10  VDDF  TEST-POINT  [PAD.03X.03]
U1  APOLLO4_BLUE_PLUS_SOC_KBR  [APOLLO4_BLUE_SOC_BGA]
X1  ABM12W  [ABM12W]
X3  TXC-9HT12  [TXC-9HT12]

### Nets
+1V8: C62.P$1 C63.P$1 C64.P$1 C65.P$1 C66.P$1 C67.P$1 C75.P$2 TP9.P$1(TESTPOINT) U1.B1(VDDP-IO_PAD_SUP) U1.C4(VDDA-ANALOG_SUP) U1.E11(VDDAUDD) U1.G1(VDDB-BLE_SUPPLY) U1.M9(VDDH2-HV_SUP) U1.M10(VDDH-HV_SUP) ; also sheet 1,2,3,6
AGND [BLE_RF]: C1.2 C93.P$2 CX5.2 U1.M1(RFIOM) U1.M3(RFSUB-RF_SUBSTRATE_GND)
AP4_!RESET: C76.1 D3.1(C) U1.A6(!RST) ; also sheet 6
AP4_GP06/TT_FLASH_!HOLD_IO3: U1.J5(GPIO6) ; also sheet 2
AP4_GP08/TT_9DOF_H_SCL/SCK/RX: U1.H2(GPIO31) ; also sheet 2
AP4_GP09/TT_9DOF_H_SDA/H_MISO/TX: U1.G2(GPIO32) ; also sheet 2
AP4_GP10/TT_9DOF_SA0/H_MOSI: U1.G3(GPIO33) ; also sheet 2
AP4_GP13/TT_9DOF_!BOOT: U1.D5(GPIO13) ; also sheet 2
AP4_GP14/TT_!DW_SPI_CS: U1.D6(GPIO14) ; also sheet 3
AP4_GP17/TT_9DOF_H_!INT: U1.D4(GPIO17) ; also sheet 2
AP4_GP18/TT_BATIN: U1.D3(GPIO18) ; also sheet 1
AP4_GP24/TT_RFSW_V1: U1.E2(GPIO24) ; also sheet 3
AP4_GP25/TT_RFSW_V2: U1.K5(GPIO25) ; also sheet 3
AP4_GP26/TT_DW_WAKEUP: U1.L5(GPIO26) ; also sheet 3
AP4_GP27/TT_DW_IRQ: U1.M5(GPIO27) ; also sheet 3
AP4_GP30/TT_FLASH_!WP: U1.G4(GPIO30) ; also sheet 2
AP4_GP31/TT_DW_SPI_CLK: U1.E8(GPIO8) ; also sheet 3
AP4_GP32/TT_DW_SPI_IO0: U1.E7(GPIO9) ; also sheet 3
AP4_GP33/TT_DW_SPI_IO1: U1.E6(GPIO10) ; also sheet 3
AP4_GP47/TT_FLASH_SCK: U1.F1(GPIO47) ; also sheet 2
AP4_GP48/TT_FLASH_PDI_IO0: U1.E1(GPIO48) ; also sheet 2
AP4_GP49/TT_FLASH_PDO_IO1: U1.D1(GPIO49) ; also sheet 2
AP4_GP50/TT_!DW_RESET: U1.A9(GPIO50) ; also sheet 3
AP4_GP51/LED1_GREEN: U1.B9(GPIO51) ; also sheet 6
AP4_GP53/LED1_RED: U1.C9(GPIO53) ; also sheet 6
AP4_GP55/TT_BUZZER_GATE: U1.D9(GPIO55) ; also sheet 2
AP4_GP58/TT_!CHG: U1.J7(GPIO58) ; also sheet 1
AP4_GP60/TT_!PG: U1.K8(GPIO60) ; also sheet 1
AP4_GP63/TT_9DOF_PS0/WAKE: U1.M6(GPIO63) ; also sheet 2
AP4_GP65/TT_9DOF_!RESET: U1.A7(GPIO65) ; also sheet 2
AP4_GP66/TT_QI_TS_CTRL: U1.A8(GPIO66) ; also sheet 1
AP4_GP69/TT_FLASH_!CS: U1.B8(GPIO69) ; also sheet 2
AP4_GP72/TT_9DOF_H_!CS: U1.C8(GPIO72) ; also sheet 2
AP4_GP79/LED2_RED: U1.M11(GPIO79) ; also sheet 6
AP4_GP80/SWTRACE0: U1.K10(GPIO80) ; also sheet 6
AP4_GP81/SWTRACE1: U1.L10(GPIO81) ; also sheet 6
AP4_GP82/SWTRACE2: U1.L9(GPIO82) ; also sheet 6
AP4_GP83/SWTRACE3: U1.K9(GPIO83) ; also sheet 6
AP4_GP88/LED2_YLW: U1.F9(GPIO88) ; also sheet 6
AP4_LPADC_VREF: C79.P$2 U1.A12(LPADC_VREF)
AP4_LPMICBIAS: C71.P$2 U1.B10(LPMICBIAS)
AP4_RFIOP1 [BLE_RF]: CX5.1 L7.1 U1.M2(RFIOP)
AP4_SWDCLK: U1.K3(GPIO20) ; also sheet 6
AP4_SWDIO: U1.J3(GPIO21) ; also sheet 6
AP4_SWO: U1.L4(GPIO3) ; also sheet 6
AP4_SWTRACECLK: U1.F12(GPIO38) ; also sheet 6
AP4_USB0_N [USB_PHY]: U1.M8(USB0PN)
AP4_USB0_P [USB_PHY]: U1.M7(USB0PP)
AP4_VDDBH: C69.1 L6.2 RZ9.1 TP8.P$1(TESTPOINT) U1.G12(VDDBH--BLE_BUCK_VOUT)
AP4_VDDBH_RF: C93.P$1 RZ9.2 U1.J1(VDDBH_RF--BLE_BUCK_RF_VOUT)
AP4_VDDBH_SW: L6.1 U1.H12(VDDBH_SW--BLE_BUCK_SW)
AP4_VDDC: C59.P$1 U1.A3(VDDC-CORE)
AP4_VDDC_LV: C60.P$1 U1.B3(VDDC_LV-CORE_LV)
AP4_VDDF: C61.P$1 C75.P$1 TP10.P$1(TESTPOINT) U1.C2(VDDF-MEM)
AP4_VDDMIPI_1P8: C70.P$1 U1.H10(VDD18-MIPI) ; also sheet 6
AP4_VDDS: C58.P$1 U1.C1(VDDS-SRAM_HV_SUP)
AP4_VDDUSB_0P9: C73.P$1 U1.L7(VDDUSB0P9) ; also sheet 6
AP4_VDDUSB_3P3: C74.P$1 U1.K7(VDDUSB33) ; also sheet 6
AP4_XI: C81.1 U1.A4(XI) X3.2
AP4_XI32M: CX4.1 U1.C12(XI32M) X1.3
AP4_XO: C80.1 U1.A5(XO) X3.1
AP4_XO32M: CX3.1 U1.D12(XO32M) X1.1
BLE_RFOUT [BLE_RF]: A4.S1(ANTENNA) L8.2
GND: C58.P$2 C59.P$2 C60.P$2 C61.P$2 C62.P$2 C63.P$2 C64.P$2 C65.P$2 C66.P$2 C67.P$2 C69.2 C70.P$2 C71.P$1 C72.P$2 C73.P$2 C74.P$2 C76.2 C79.P$1 C80.2 C81.2 CX3.2 CX4.2 D3.2(A) U1.B2(VSSP-BUCK_REGS_GND) U1.B5(VSSA-ANALOG_GND) U1.B12(VSSAUDA) U1.D2(VSS-DGND_FOR_VDDF_AND_PADS) U1.E12(VSSAUDD) U1.H1(VSSB-BLE_UNREG_GND) U1.J10(VSS18-MIPI) U1.L1(VSSVCO-BLECORE_GND_FOR_VCO) U1.L2(VSSS-HVSIMOBUCK_GND) U1.L8(VSSAUSB) X1.2(GND) X1.4(GND) ; also sheet 1,2,3,6
N$3 [BLE_RF]: C1.1 L7.2 L8.1
SIMOBUCK_SW: L5.P$1 U1.A1(SIMOBUCK_SW)
SIMOBUCK_SWSEL: L5.P$2 U1.A2(SIMOBUCK_SWSEL)
VDDAUDA_1P8-CLEAN: C72.P$1 U1.B11(VDDAUDA) ; also sheet 6
Unconnected: U1.A10(LPADC_D0NSE0) U1.A11(LPADC_D0PSE1) U1.B4(GPIO12) U1.B6(GPIO64) U1.B7(GPIO68) U1.C3(GPIO19) U1.C5(GPIO70) U1.C6(GPIO67) U1.C7(GPIO71) U1.C10(GPIO52) U1.C11(LPADC_D1NSE2) U1.D7(GPIO16) U1.D8(GPIO73) U1.D10(GPIO54) U1.D11(LPADC_D1PSE3) U1.E3(GPIO28) U1.E4(GPIO11) U1.E5(GPIO15) U1.E9(GPIO57) U1.E10(GPIO56) U1.F2(GPIO23) U1.F3(GPIO22) U1.F4(GPIO29) U1.F10(GPIO89) U1.F11(GPIO37) U1.G9(GPIO87) U1.G10(GPIO86) U1.G11(GPIO74) U1.H3(GPIO0) U1.H4(GPIO5) U1.H9(GPIO85) U1.H11(GPIO75) U1.J2(GPIO90) U1.J4(GPIO1) U1.J6(GPIO7) U1.J8(GPIO59) U1.J9(GPIO84) U1.J11(GPIO76) U1.J12(MIPI_CLKN) U1.K1(TXEN) U1.K2(GPIO91) U1.K4(GPIO2) U1.K6(GPIO61) U1.K11(GPIO77) U1.K12(MIPI_CLKP) U1.L6(GPIO62) U1.L11(GPIO78) U1.L12(MIPI_DON) U1.M4(GPIO4) U1.M12(MIPI_DOP)

### Notes on the sheet
- Apollo4 Blue Plus
- Supply 1.8-2.0 V
  
   M4 max sust:   4 mA
   Buck spikes: 100 mA
   BLE max sus:   6 mA (+1.2?)
  BLE buck spk: 2.2 mA
- AP4 datasheet—    
  XI/XO int C: 3.4pF
    max ext C: 7  pF
- AP4 datasheet—    
  XI/XO int C:   3.4pF
       C-load:   6  pF
  (max)   ESR: 100   Ω
- Note: Load caps DNP after
  first-gen fab testing.
  
  EVB Populates with 6pF
- Note: Load caps DNP on
  Ambiq reference assembly
- For the KBR package of the
  Apollo4 Blue Plus SoC, the
  pins available for chip enables
  for the MSPI instances are
  limited to: GPIO14, 52, 56, 57,
  60, 73, 75, 83, 84, 85, 86 and 91.
- Pad
  Fn2
- MSPI0
- IOM0 | IOM1 | IOM7 | IOM2 | IOM3 | IOM5 | IOM6
- SWD
  Pins
  (req)
- Pad
  Fn0
- Int PUs,
  safe float
- I/O Planning Notes
- 3 MSPI instances
   - MSPI0 seems normal, use → GPIO64-73 (PadFn0)
   - MSPI1-2 have many caveats, avoid
- If Unused:
  Float data;
  gnd usb pwr
- Route USB0PN and
  USB0PP as 90Ω
  differential pair
- KBR Package
- 7 IOM (I2C/SPI), two power domains
   - IOM0-3 HCPB
   - IOM5-7 HCPC
  IOMn_SUBMODCTRL_SMODnEN reg disables submodule
- Route CLKN, CLKP
  as 100Ω diff pair and
  50Ω single-ended trcs
- If Unused
  (no display):
  Float clk,data;
  gnd pwr
- Timers (PWM/buzzer) any GPIO pin (Pad Fn6)
- Route D0N and D0P
  as 100Ω diff pair and
  50Ω signle-ended trcs
- VREF generated internally, ext cap is filter
- NOTE: EVB and ref sch
  have a 0.1uF here.
  As this is unused,
  replaced with 1uF
  to reduce BOM count.
- Pad
  Fn4
- Unused (no mic yet..)
  Float inputs and bias out
  VRef always gen'd internally
  and expects 100nF cap
- No idea what this does :(
  
  Datasheet doesn't explain anywhere.
  Reference board just pins out to general header
- EVB Hedges
  BLE RF Supply
- §30.2.4-6 Recommended Buck,Bypass,Ext Components
- EVB Adds Cap Between VDDP and VDDF

## Sheet 6 of 6: AP4 Support Circuits
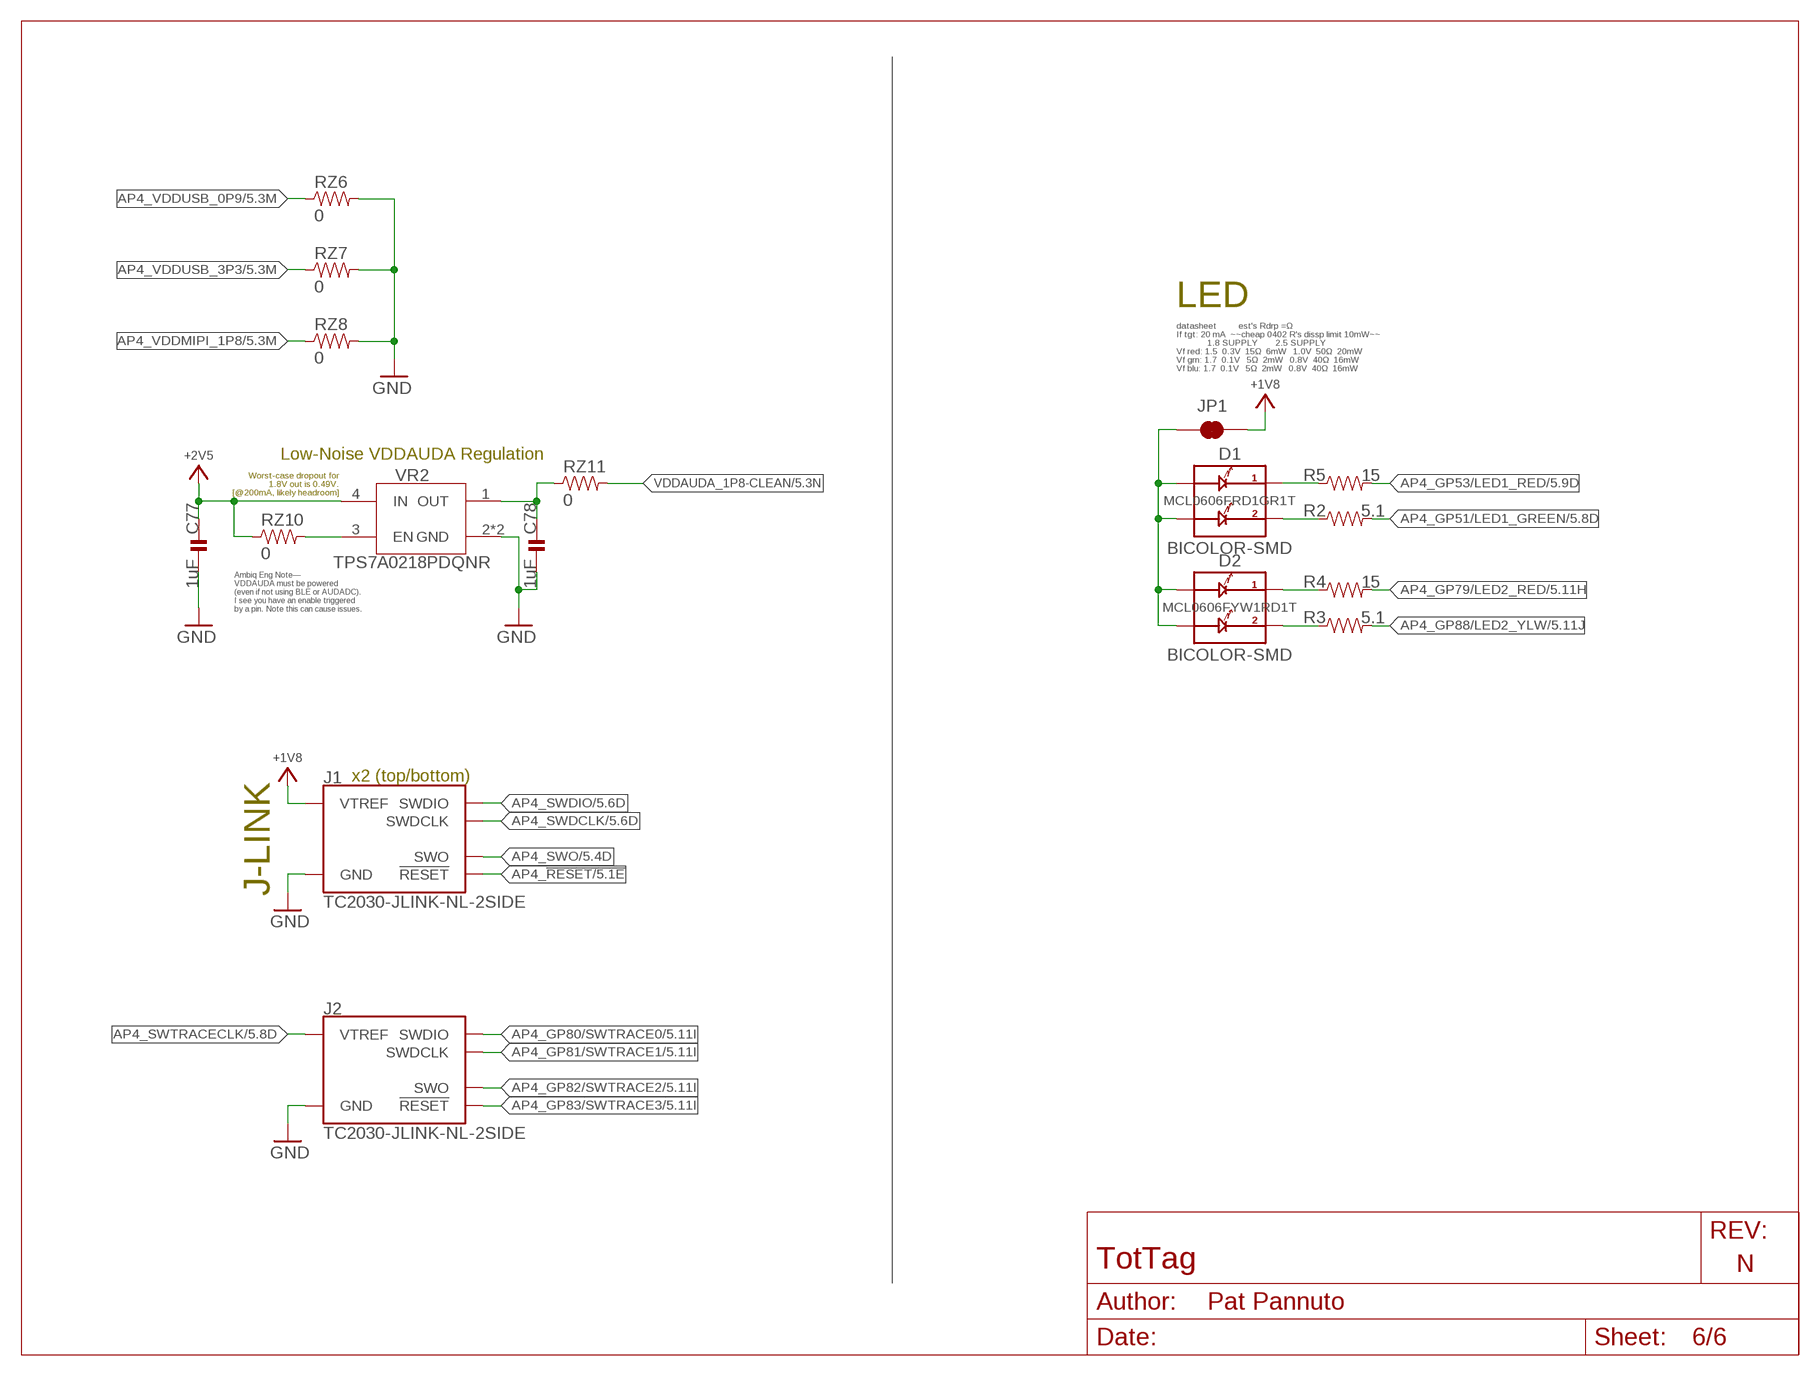
[diagram p5: schematic, sheet 6]

### Parts
C77  1uF  CAPACITOR0201_CAP  [0201_CAP]
C78  1uF  CAPACITOR0201_CAP  [0201_CAP]
D1  BICOLOR-SMD  [LED-0606]
D2  BICOLOR-SMD  [LED-0606]
J1  TC2030-JLINK-NL-2SIDE  [TC2030-IDC-NL-2SIDE]
J2  TC2030-JLINK-NL-2SIDE  [TC2030-IDC-NL-2SIDE]
JP1  JUMPER-SMT_2_NC_TRACE_SILK  [SMT-JUMPER_2_NC_TRACE_SILK]
R2  5.1  RESISTOR0402_RES  [0402_RES]
R3  5.1  RESISTOR0402_RES  [0402_RES]
R4  15  RESISTOR0402_RES  [0402_RES]
R5  15  RESISTOR0402_RES  [0402_RES]
RZ6  0  RESISTOR0402_RES  [0402_RES]
RZ7  0  RESISTOR0402_RES  [0402_RES]
RZ8  0  RESISTOR0402_RES  [0402_RES]
RZ10  0  RESISTOR0402_RES  [0402_RES]
RZ11  0  RESISTOR0402_RES  [0402_RES]
VR2  TPS7A0218PDQNR  [4-XDFN-EP]

### Nets
+1V8: J1.1(VTREF) J1.B1(VTREF) JP1.2 ; also sheet 1,2,3,5
+2V5: C77.P$1 RZ10.1 VR2.4(IN) ; also sheet 1,2,3
AP4_!RESET: J1.3(!RESET) J1.B3(!RESET) ; also sheet 5
AP4_GP51/LED1_GREEN: R2.2 ; also sheet 5
AP4_GP53/LED1_RED: R5.2 ; also sheet 5
AP4_GP79/LED2_RED: R4.2 ; also sheet 5
AP4_GP80/SWTRACE0: J2.2(SWDIO) J2.B2(SWDIO) ; also sheet 5
AP4_GP81/SWTRACE1: J2.4(SWDCLK) J2.B4(SWDCLK) ; also sheet 5
AP4_GP82/SWTRACE2: J2.6(SWO) J2.B6(SWO) ; also sheet 5
AP4_GP83/SWTRACE3: J2.3(!RESET) J2.B3(!RESET) ; also sheet 5
AP4_GP88/LED2_YLW: R3.2 ; also sheet 5
AP4_LED2_BLUE_COMM: D1.C1 R5.1
AP4_LED_BLUE_COMM: D2.C2 R3.1
AP4_LED_GREEN_COMM: D2.C1 R4.1
AP4_LED_RED_COMM: D1.C2 R2.1
AP4_SWDCLK: J1.4(SWDCLK) J1.B4(SWDCLK) ; also sheet 5
AP4_SWDIO: J1.2(SWDIO) J1.B2(SWDIO) ; also sheet 5
AP4_SWO: J1.6(SWO) J1.B6(SWO) ; also sheet 5
AP4_SWTRACECLK: J2.1(VTREF) J2.B1(VTREF) ; also sheet 5
AP4_VDDMIPI_1P8: RZ8.1 ; also sheet 5
AP4_VDDUSB_0P9: RZ6.1 ; also sheet 5
AP4_VDDUSB_3P3: RZ7.1 ; also sheet 5
GND: C77.P$2 C78.P$2 J1.5(GND) J1.B5(GND) J2.5(GND) J2.B5(GND) RZ6.2 RZ7.2 RZ8.2 VR2.2(GND) VR2.PAD(GND) ; also sheet 1,2,3,5
LED_SUP: D1.A1 D1.A2 D2.A1 D2.A2 JP1.1
VDDAUDA_1P8-CLEAN: RZ11.2 ; also sheet 5
VR2_EN: RZ10.2 VR2.3(EN)
VR2_OUT: C78.P$1 RZ11.1 VR2.1(OUT)

### Notes on the sheet
- LED
- datasheet          est's Rdrp =Ω
  If tgt: 20 mA  ~~cheap 0402 R's dissp limit 10mW~~
                1.8 SUPPLY        2.5 SUPPLY
  Vf red: 1.5  0.3V  15Ω  6mW   1.0V  50Ω  20mW
  Vf grn: 1.7  0.1V   5Ω  2mW   0.8V  40Ω  16mW
  Vf blu: 1.7  0.1V   5Ω  2mW   0.8V  40Ω  16mW
- Low-Noise VDDAUDA Regulation
- Worst-case dropout for
  1.8V out is 0.49V.
  [@200mA, likely headroom]
- Ambiq Eng Note—
  VDDAUDA must be powered
  (even if not using BLE or AUDADC).
  I see you have an enable triggered
  by a pin. Note this can cause issues.
- x2 (top/bottom)
- J-LINK

## Library data of the parts
A1-A3 = antennas:ACR0301U; MANUFACTURER: Abracon; MPN: ACR0301U
A4 = antennas:AMCA72-2R47G-S1F-T: WiFi/Bluetooth/ZigBee, ISM Atenna Abracon Page <https://abracon.com/parametric/antennas/AMCA72-2R470G-S1F-T>; DESCRIPTION: RF ANT 2.4GHZ CHIP SOLDER SMD; DIGIKEY: 535-14108-1-ND; MPN: AMCA72-2R470G-S1F-T4
C1 = Capacitor:C: Capacitor - Generic; CATEGORY: Capacitor; DESCRIPTION: CAP CER 1.5PF 50V C0G/NP0 0402; MANUFACTURER: KEMET; MPN: C0402C159C5GAC7867; TEMPCOEFF: NP0; TOLERANCE: +/- 0.25pF
C2 = passives:CAPACITOR: SMD Capacitor; MPN: CBR02C209A5GAC
C3 C4 = worthington:C; EIA: C0G; MANUFACTURER: KYOCERA AVX; MPN: 600F3R3BT250XT
C5 C6 = passives:CAPACITOR: SMD Capacitor; MANUFACTURER: Murata; MPN: GRM0335C1H4R0BA01D
C7 C8 = passives:CAPACITOR: SMD Capacitor; MPN: GRM0335C1H220FA01D
C9 C10 = passives:CAPACITOR: SMD Capacitor; DESCRIPTION: CAP CER 470PF 50V C0G/NP0 0402; DIGIKEY: 490-6242-1-ND; MANUFACTURER: Murata; MPN: GRM1555C1H471JA01J
C11 = worthington:C; EIA: C0G; MPN: GRM31C5C1H104JA01L
C12-C14 = worthington:C; EIA: C0G; FEATURES: Low ESL; MANUFACTURER: KEMET; MPN: C0603C472J5GAC7867
C15 C16 = passives:CAPACITOR: SMD Capacitor; DIGIKEY: 490-6351-2-ND; MPN: GRM155R71H103KA88J
C17-C19 = passives:CAPACITOR: SMD Capacitor; DIGIKEY: 490-10699-2-ND; MPN: GRM155R71E223JA61D
C20 C21 = passives:CAPACITOR: SMD Capacitor; DIGIKEY: 311-3823-1-ND; MPN: CC0402ZRY5V8BB223
C22 C24 = worthington:C; FEATURES: Low ESL; MPN: C1608X7R1H104K080AA
C23 C25 C26 C31-C36 = passives:CAPACITOR: SMD Capacitor; MPN: CL05A104KP5NNNC
C27-C30 = passives:CAPACITOR: SMD Capacitor; DIGIKEY: 490-6328-1-ND; MPN: GRM155R71C104KA88J
C37 = worthington:C; FEATURES: Low ESL; MPN: C1608X7R1H224K080AB
C38 C39 = passives:CAPACITOR: SMD Capacitor; DIGIKEY: 490-12270-1-ND; MPN: GRT155R61E474ME01D
C40-C42 C44 = passives:CAPACITOR: SMD Capacitor; MPN: GRM155R70J105KA12J
C43 = worthington:C; EIA: C0G; MPN: C0402C101J3GACTU
C45-C50 = passives:CAPACITOR: SMD Capacitor; APPLICATION: SMPS Filter; MPN: C1608X7S1A475K080AC
C53 C56 C57 = passives:CAPACITOR: SMD Capacitor; DIGIKEY: 1253-CM105X5R106M25ATCT-ND; MPN: CM105X5R106M25AT
C54 C55 = worthington:C; MPN: CM105X5R106M25AT
C58-C61 C66 C67 C70-C75 = passives:CAPACITOR: SMD Capacitor; MANUFACTURER: Murata; MPN: GRM033R61A225KE47D
C62-C65 C77 C78 C90 C91 C93 = passives:CAPACITOR: SMD Capacitor; MANUFACTURER: Murata; MPN: GRM033R61A105ME44D
C69 = passives:CAPACITOR: SMD Capacitor; MPN: CL05A475MP5NRNC
C76 = Capacitor:C: Capacitor - Generic; CATEGORY: Capacitor; MPN: KGM05AR71E472KH
C79 = passives:CAPACITOR: SMD Capacitor; MANUFACTURER: MURATA; MPN: GRM033R61A105ME44D
C80 C81 = Capacitor:C: Capacitor - Generic; CATEGORY: Capacitor; MANUFACTURER: Murata; MPN: GCM1555C1H6R0BA16D
CX1 CX2 = passives:CAPACITOR: SMD Capacitor
CX3-CX5 = Capacitor:C: Capacitor - Generic; CATEGORY: Capacitor
D1 = leds:BICOLOR-SMD; MPN: MCL0606FRD1GR1T
D2 = leds:BICOLOR-SMD; MPN: MCL0606FYW1RD1T
D3 = Diode:ZENER: Zener Diode - Generic; CATEGORY: Diode; DESCRIPTION: DIODE TVS 5.5V STANDOFF 8V BREAKDOWN SC79; MANUFACTURER: NXP SEMICONDUCTOR; MPN: PESD5V0X1UB,135; SUB-CATEGORY: Zener
D4 = passives:DIODE; DIGIKEY: 641-2087-1-ND; MPN: CDSQR400B-HF
FB1 = passives:FERRITE_BEAD; MANUFACTURER: Murata; MPN: BLM03PG330SN1D
FD1 FD2 FD4 FD6 = Quorvo:FIDUCIAL
J1 J2 = connector:TC2030-JLINK
J4 = connector:MOLEX-PICO-SPOX-3: MOLEX 1.50mm Pitch, Pico-SPOX PCB Header, Single Row, Surface Mount. Default connector of Shenzhen LiPo + Thermistor suppliers ca. 2020.; DIGIKEY: WM7647CT-ND; MFN: 874380343
JP1 = SparkFun-Jumpers:JUMPER-SMT_2_NC_TRACE: Normally closed trace jumper This jumper has a trace between two pads so it's normally closed (NC). Use a razor knife to open the connection. For best results follow the IPC guidelines for cutting traces: Cutout at least 0.063 mm (0.005 in). Remove all loose material to clean up the cut area. Seal the cut with an approved epoxy. Reapply solder to reclose the connection.
JP2 JP3 JP12 = SparkFun-Jumpers:JUMPER-SMT_3_1-NC_TRACE: Normally closed trace jumper (1 of 2 connections) This jumper has a trace between two pads so it's normally closed (NC). The other connection is normally open (NO). Use a razor knife to open the connection. For best results follow the IPC guidelines for cutting traces: Cutout at least 0.063 mm (0.005 in). Remove all loose material to clean up the cut area. Seal the cut with an approved epoxy. Reapply solder to reclose the connection, or to close the NO connection.
JP9 = pinhead:PINHD-1X2: PIN HEADER
JP10 JP11 = pinhead:PINHD-1X1: PIN HEADER
L1 L2 = passives:INDUCTOR: A very specific inductor; MANUFACTURER: TAIYO YUDEN; MPN: NR3015T100M
L4 = ac:WURTH_COIL_760308103204; DIGIKEY: 732-5258-ND; MANUFACTURER: Würth Elektronik; MPN: 760308103204
L5 = passives:INDUCTOR: A very specific inductor; MANUFACTURER: Murata; MPN: DFE201210U-2R2M=P2
L6 = passives:INDUCTOR: A very specific inductor; MANUFACTURER: Murata; MPN: DFE18SAN1R0ME0L
L7 = Inductor:L: Inductor Fixed - Generic; CATEGORY: Inductor; DESCRIPTION: FIXED IND 2.0NH0.1NH SMD; MANUFACTURER: Central Technologies; MPN: CTTF0402F-2N0B; SUB-CATEGORY: Fixed; TOLERANCE: +/- 0.1 nH
L8 = Inductor:L: Inductor Fixed - Generic; CATEGORY: Inductor; DESCRIPTION: FIXED IND 2.2NH0.1NH SMD; MANUFACTURER: Central Technologies; MPN: CTTF0402F-2N2B; SUB-CATEGORY: Fixed; TOLERANCE: +/- 0.1 nH
LS1 = audio:PUI_SMT-0440-T-2-R; DIGIKEY: 668-SMT-0440-T-2-RTR-ND; MPN: SMT-0440-T-2-R
Q1 = fets:CSD75207W15: low on resistance, gate charge dual p-channel nexfet; DIGIKEY: 296-40008-1-ND; MANUFACTURER: TEXAS INSTRUMENTS; MPN: CSD75207W15
Q2 = fets:MOSFET-NCHANNEL: Generic NMOS footprint; DIGIKEY: DMN2400UFB4-7DICT-ND
R1 = passives:RESISTOR: Resistor Basic schematic elements and footprints for 0201, 0402, 0603, 1206, and PTH resistors.; MPN: ERJ-1GNF49R9C
R2 R3 = passives:RESISTOR: Resistor Basic schematic elements and footprints for 0201, 0402, 0603, 1206, and PTH resistors.; MPN: RC0402JR-075R1L
R4 R5 = passives:RESISTOR: Resistor Basic schematic elements and footprints for 0201, 0402, 0603, 1206, and PTH resistors.; MPN: RC0402JR-0715RL
R6 R7 = passives:RESISTOR: Resistor Basic schematic elements and footprints for 0201, 0402, 0603, 1206, and PTH resistors.; DIGIKEY: RMCF0402FT97R6CT-ND; MPN: RMCF0402FT97R6
R8 R9 = passives:RESISTOR: Resistor Basic schematic elements and footprints for 0201, 0402, 0603, 1206, and PTH resistors.; DIGIKEY: RMCF0402FT162RCT-ND; MPN: RMCF0402FT162R
R12 R16 R18 R20 R23 XR19 = passives:RESISTOR: Resistor Basic schematic elements and footprints for 0201, 0402, 0603, 1206, and PTH resistors.; DIGIKEY: 311-10KJRCT-ND; MPN: RC0402JR-0710KL
R13 R14 RX1 RX2 RX5-RX9 = passives:RESISTOR: Resistor Basic schematic elements and footprints for 0201, 0402, 0603, 1206, and PTH resistors.
R15 = passives:RESISTOR: Resistor Basic schematic elements and footprints for 0201, 0402, 0603, 1206, and PTH resistors.; DIGIKEY: RMCF0402JT2K20CT-ND; MPN: RMCF0402JT2K20
R24 R25 = passives:RESISTOR: Resistor Basic schematic elements and footprints for 0201, 0402, 0603, 1206, and PTH resistors.; MPN: RT0402BRE07100KL
R26 = passives:RESISTOR: Resistor Basic schematic elements and footprints for 0201, 0402, 0603, 1206, and PTH resistors.; MPN: ERJ-1GNF2613C
R27 = passives:RESISTOR: Resistor Basic schematic elements and footprints for 0201, 0402, 0603, 1206, and PTH resistors.; MPN: ERJ-1GNF4023C
R28 R29 = passives:RESISTOR: Resistor Basic schematic elements and footprints for 0201, 0402, 0603, 1206, and PTH resistors.; MPN: ERJ-1GNF8453C
R30 = passives:RESISTOR: Resistor Basic schematic elements and footprints for 0201, 0402, 0603, 1206, and PTH resistors.; MPN: RMCF0402FT1M87; TOLERANCE: 1%
R31 = passives:RESISTOR: Resistor Basic schematic elements and footprints for 0201, 0402, 0603, 1206, and PTH resistors.; DIGIKEY: RMCF0402FT5M10CT-ND; MPN: RMCF0402FT5M10; TOLERANCE: 1%
R33 R34 = passives:RESISTOR: Resistor Basic schematic elements and footprints for 0201, 0402, 0603, 1206, and PTH resistors.; DIGIKEY: RMCF0402FT5M10CT-ND; MPN: RMCF0402FT5M10
RT1 = passives:THERMISTOR: Thermistor. Temperature-controller resistor.; DIGIKEY: 490-18149-1-ND; MPN: NCU15XH103F60RC
RZ1 RZ2 = passives:RESISTOR: Resistor Basic schematic elements and footprints for 0201, 0402, 0603, 1206, and PTH resistors.; MPN: RMCF0603ZT0R00; SUBSTITUTE: ANY
RZ4 RZ6-RZ12 = passives:RESISTOR: Resistor Basic schematic elements and footprints for 0201, 0402, 0603, 1206, and PTH resistors.; MPN: RMCF0402ZT0R00; SUBSTITUE: Any
S1 = Wurth_Switch_WS-SLSU:450404015514: WS-SLSU Mini Slide Switch, Same Side Connection Side Push 6.7x2.7 mm Properties Actuator Material:PA46 Actuator Flammability Rating:UL94 HB Actuator Color:Black Frame Material:LCP Frame Flammability Rating:UL94 V-0 Frame Color:Black Contact Material:Copper Alloy Contact Plating:Silver Terminal Material:Copper Alloy Terminal Plating:Silver Switching Function:On-On Schematic:SPDT Connection Type:Same Side Connection Qty.:3300 Material Properties Cover Material:Stainless Steel General Information Operating Temperature:-40 up to +85 °C Packaging Properties Packaging :Tape and Reel <https://www.we-online.com/catalog/media/o76706v209%20Family_WS-SLSU_Gruppe.jpg> Details see: https://www.we-online.com/catalog/en/SLSU_6_7X_2_7_SMD_HORIZONTAL/ Updated by yingchun,Shan;2020-02-25 2020(C) Würth Elektronik; DATASHEET-URL: https://www.we-online.com/catalog/datasheet/450404015514.pdf; DIGIKEY: 732-13665-1-ND; IR: 300mA; PACKAGING: Tape and Reel; PART-NUMBER: 450404015514; QTY: 150; VR: 5V(DC)
S2 = switches:SKY13373: 0.1 to 8.0 GHz SP3T Switch; MANUFACTURER: Skyworks; MPN: SKY13373-460LF
S3 = switches:SIP3241X; MANUFACTURER: Vishay; MPN: SIP32414DNP-T1-GE4
S4 = switches:MM8030-2610; DURABILITY: 100 Cycles; FREQ-MAX: 11 GHz; MANUFACTURER: Murata; MPN: MM8030-2610
TP0 TP1-TP10 = headers:TEST-POINT
U1 = Quorvo:APOLLO4_BLUE_PLUS_SOC_KBR; DESCRIPTION: IC - SoC Cortex-M4 and BLE Radio with M0, 4.7x4.7mm 131-pin BGA; MANUFACTURER: Ambiq; MPN: AMA4B2KP-KBR
U2 = Quorvo:DW3110; MANUFACTURER: Qorvo; MPN: DW3110
U3 = chips:BQ24040: Simple Li Ion / Li Poly charger.; DIGIKEY: 296-37142-1-ND; MPN: BQ24040DSQR
U4 = chips:BQ51013B: bq51013B Highly Integrated Wireless Receiver Qi (WPC v1.2) Compliant Power Supply; DIGIKEY: 296-38885-1-ND; MPN: BQ51013BRHLR
U6 = Quorvo:BNO086; DIGIKEY: 1888-BNO086; MANUFACTURER: CEVA Technologies, Inc.; MPN: BNO086
U7 = Quorvo:QM14068; MANUFACTURER: Qorvo; MPN: QM14068
U8 = Quorvo:AS5FXXX04SND; MANUFACTURER: Alliance Memory; MPN: AS5F18G04SND-10LIN
VR1 = regulators:RT8020; MANUFACTURER: RichTek; MPN: RT8020GQW
VR2 VR3 = regulators:TPS7A02; MPN: TPS7A0218PDQNR
X1 = crystals:ABM12W; C-LOAD: 6pF; FREQUENCY: 32 MHz; MANUFACTURER: Abracon; MAX-ESR: 80Ω; MPN: ABM12W-32.0000MHZ-6-D1X-T3
X2 X3 = crystals:TXC-9HT12; C-LOAD: 7pF; FREQUENCY: 32.768 kHz; MANUFACTURER: TXC Corp; MPN: 9HT12-32.768KDZY-T
X4 = crystals:TXC-8Y: 2mmx1.6mm SMD Crystal
XJ1 = connector:USB4110-GF-A: CONN USB 2.0 TYPE-C R/A SMT; DESCRIPTION: USB-C (USB TYPE-C) USB 2.0 Receptacle Connector 24 (16+8 Dummy) Position Surface Mount, Right Angle; Through Hole; DIGIKEY: 2073-USB4110-GF-A-1-ND; MF: GCT; MPN: USB4110-GF-A; PACKAGE: None
XR16 XR17 = passives:RESISTOR: Resistor Basic schematic elements and footprints for 0201, 0402, 0603, 1206, and PTH resistors.; DIGIKEY: RMCF0402FT5K10CT-ND; MPN: RMCF0402FT5K10

## Net classes
1 BLE_RF: width 0.22 mm, clearance 0.15 mm
2 UWB_RF: width 0.22 mm, clearance 0.15 mm
3 USB_PHY: width 0.152 mm, clearance 0.305 mm
4 UWB_XTAL: width 0.22 mm, clearance 0.15 mm